# EAGLE design PowerPCB (EAGLE 9.4.2)

## Sheet 1 of 4
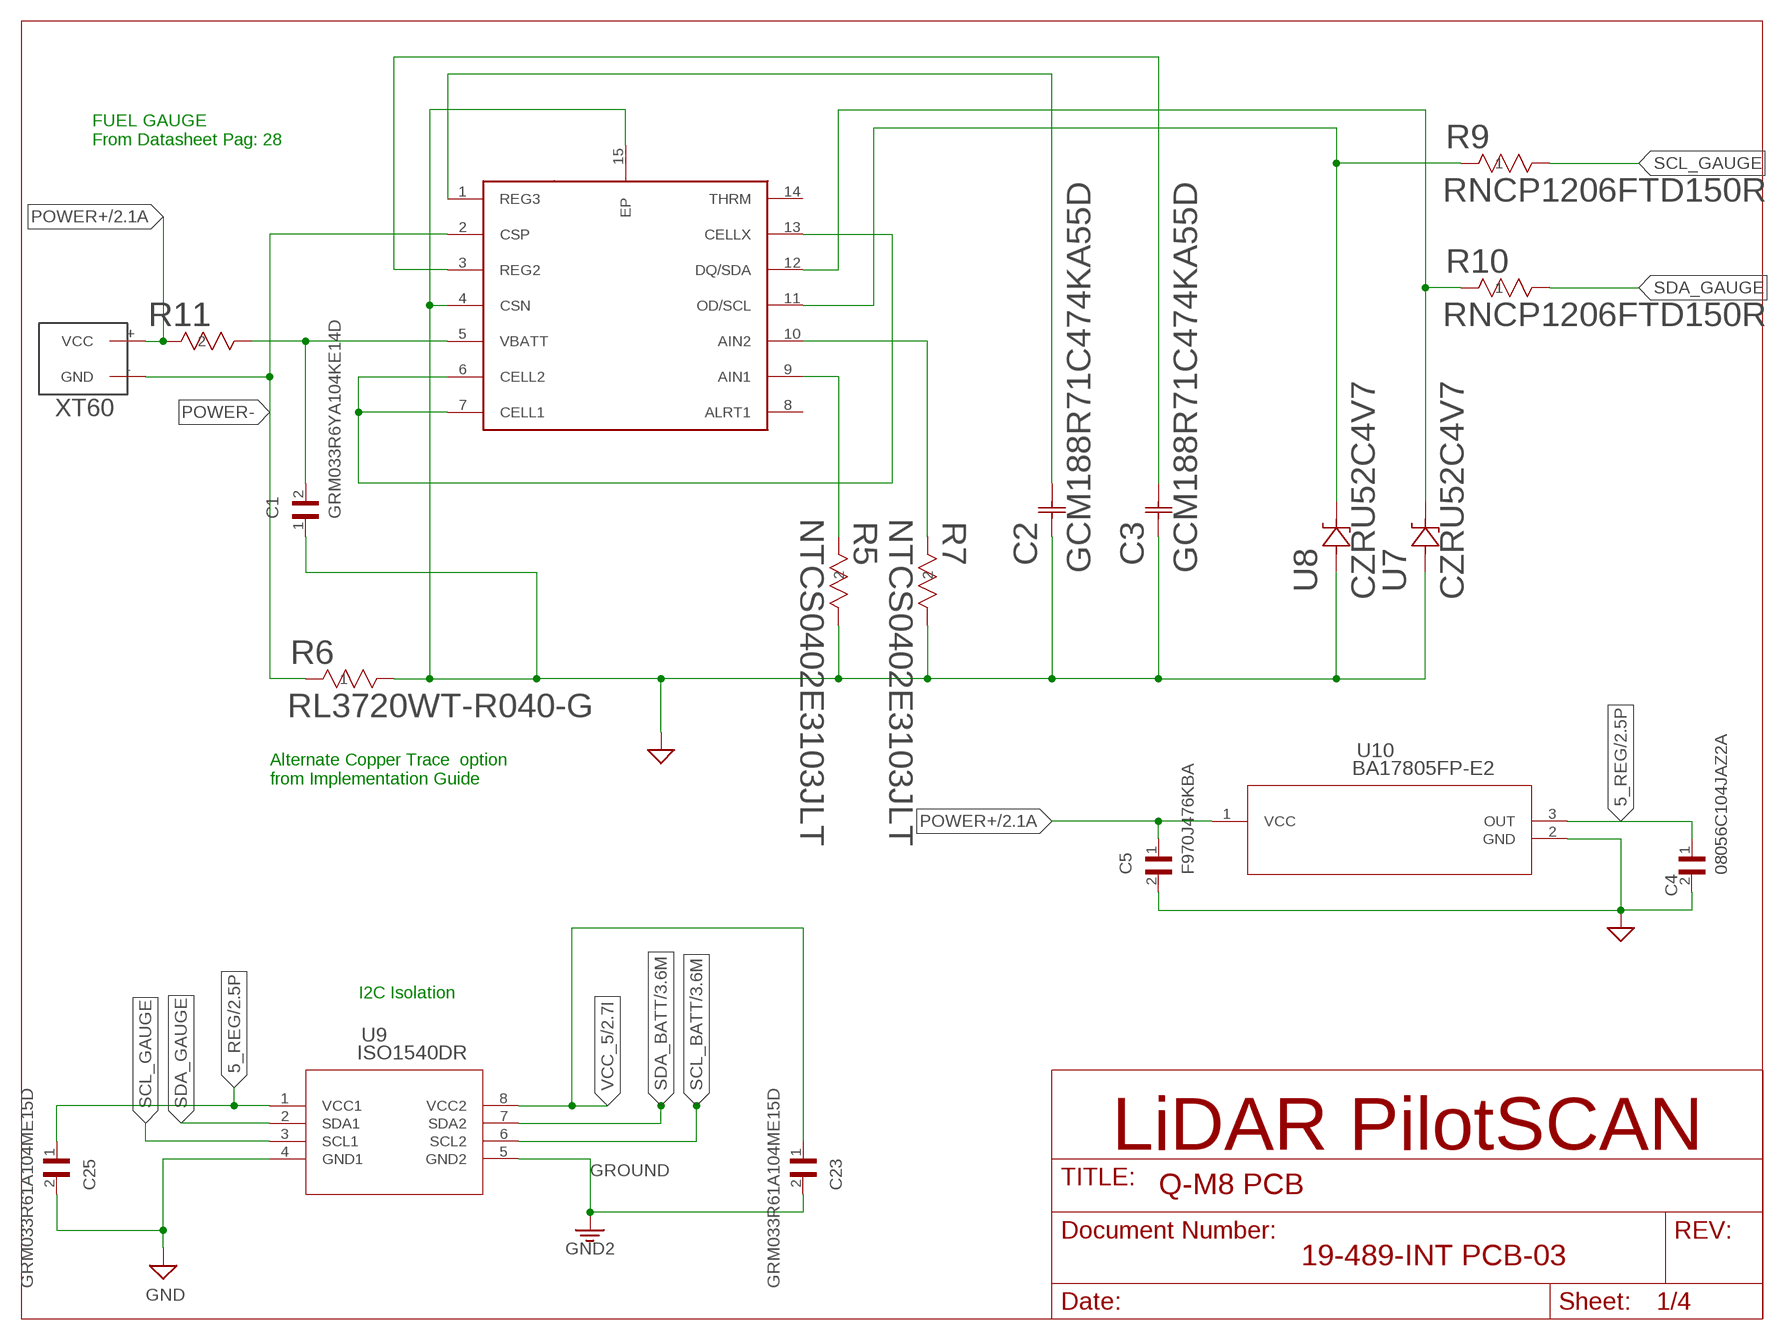
[diagram p0: schematic, sheet 1]

### Parts
C1  GRM033R6YA104KE14D  [CAPC0603X33N]
C2  GCM188R71C474KA55D  [G-188]
C3  GCM188R71C474KA55D  [G-188]
C4  08056C104JAZ2A  [CAPC2012X140N]
C5  F970J476KBA  [CAPPC3528X210N]
C23  GRM033R61A104ME15D  [CAPC0603X33N]
C25  GRM033R61A104ME15D  [CAPC0603X33N]
J5  XT60  [XT60]
R5  NTCS0402E3103JLT  [RES_0402_NTC]
R6  RL3720WT-R040-G  [RES_2037]
R7  NTCS0402E3103JLT  [RES_0402_NTC]
R9  RNCP1206FTD150R  [STA_RNCP1206]
R10  RNCP1206FTD150R  [STA_RNCP1206]
R11  ERA-2AKD100X  [RC0402N]
U5  MAX17205G+T  [MAX17205G+T]
U7  CZRU52C4V7  [CZRU]
U8  CZRU52C4V7  [CZRU]
U9  ISO1540DR  [D8]
U10  BA17805FP-E2  [TO252-3]

### Nets
5_REG: C4.1 C25.1 U9.1(VCC1) U10.3(OUT) ; also sheet 2
GND: C1.1 C2.1 C3.1 C4.2 C5.2 C25.2 R5.1 R6.2 R7.1 U5.4(CSN) U5.15(EP) U7.2 U8.2 U9.4(GND1) U10.2(GND) ; supply symbol labelled SUP ; also sheet 2
GROUND: C23.2 U9.5(GND2) ; supply symbol labelled GND2 ; also sheet 2,3,4
N$7: C1.2 R11.1 U5.5(VBATT)
N$8: R5.2 U5.9(AIN1)
N$25: C2.2 U5.1(REG3)
N$28: R7.2 U5.10(AIN2)
N$31: C3.2 U5.3(REG2)
N$32: U5.6(CELL2) U5.7(CELL1) U5.13(CELLX)
N$34: R9.1 U5.11(OD/SCL) U8.1
N$35: R10.1 U5.12(DQ/SDA) U7.1
POWER+: C5.1 J5.+(VCC) R11.2 U10.1(VCC) ; also sheet 2
POWER-: J5.-(GND) R6.1 U5.2(CSP)
SCL_BATT: U9.6(SCL2) ; also sheet 3
SCL_GAUGE: R9.2 U9.3(SCL1)
SDA_BATT: U9.7(SDA2) ; also sheet 3
SDA_GAUGE: R10.2 U9.2(SDA1)
VCC_5: C23.1 U9.8(VCC2) ; also sheet 2,3,4
Unconnected: U5.8(ALRT1) U5.14(THRM)

### Notes on the sheet
- FUEL GAUGE
  From Datasheet Pag: 28
- Alternate Copper Trace  option
  from Implementation Guide
- I2C Isolation

## Sheet 2 of 4
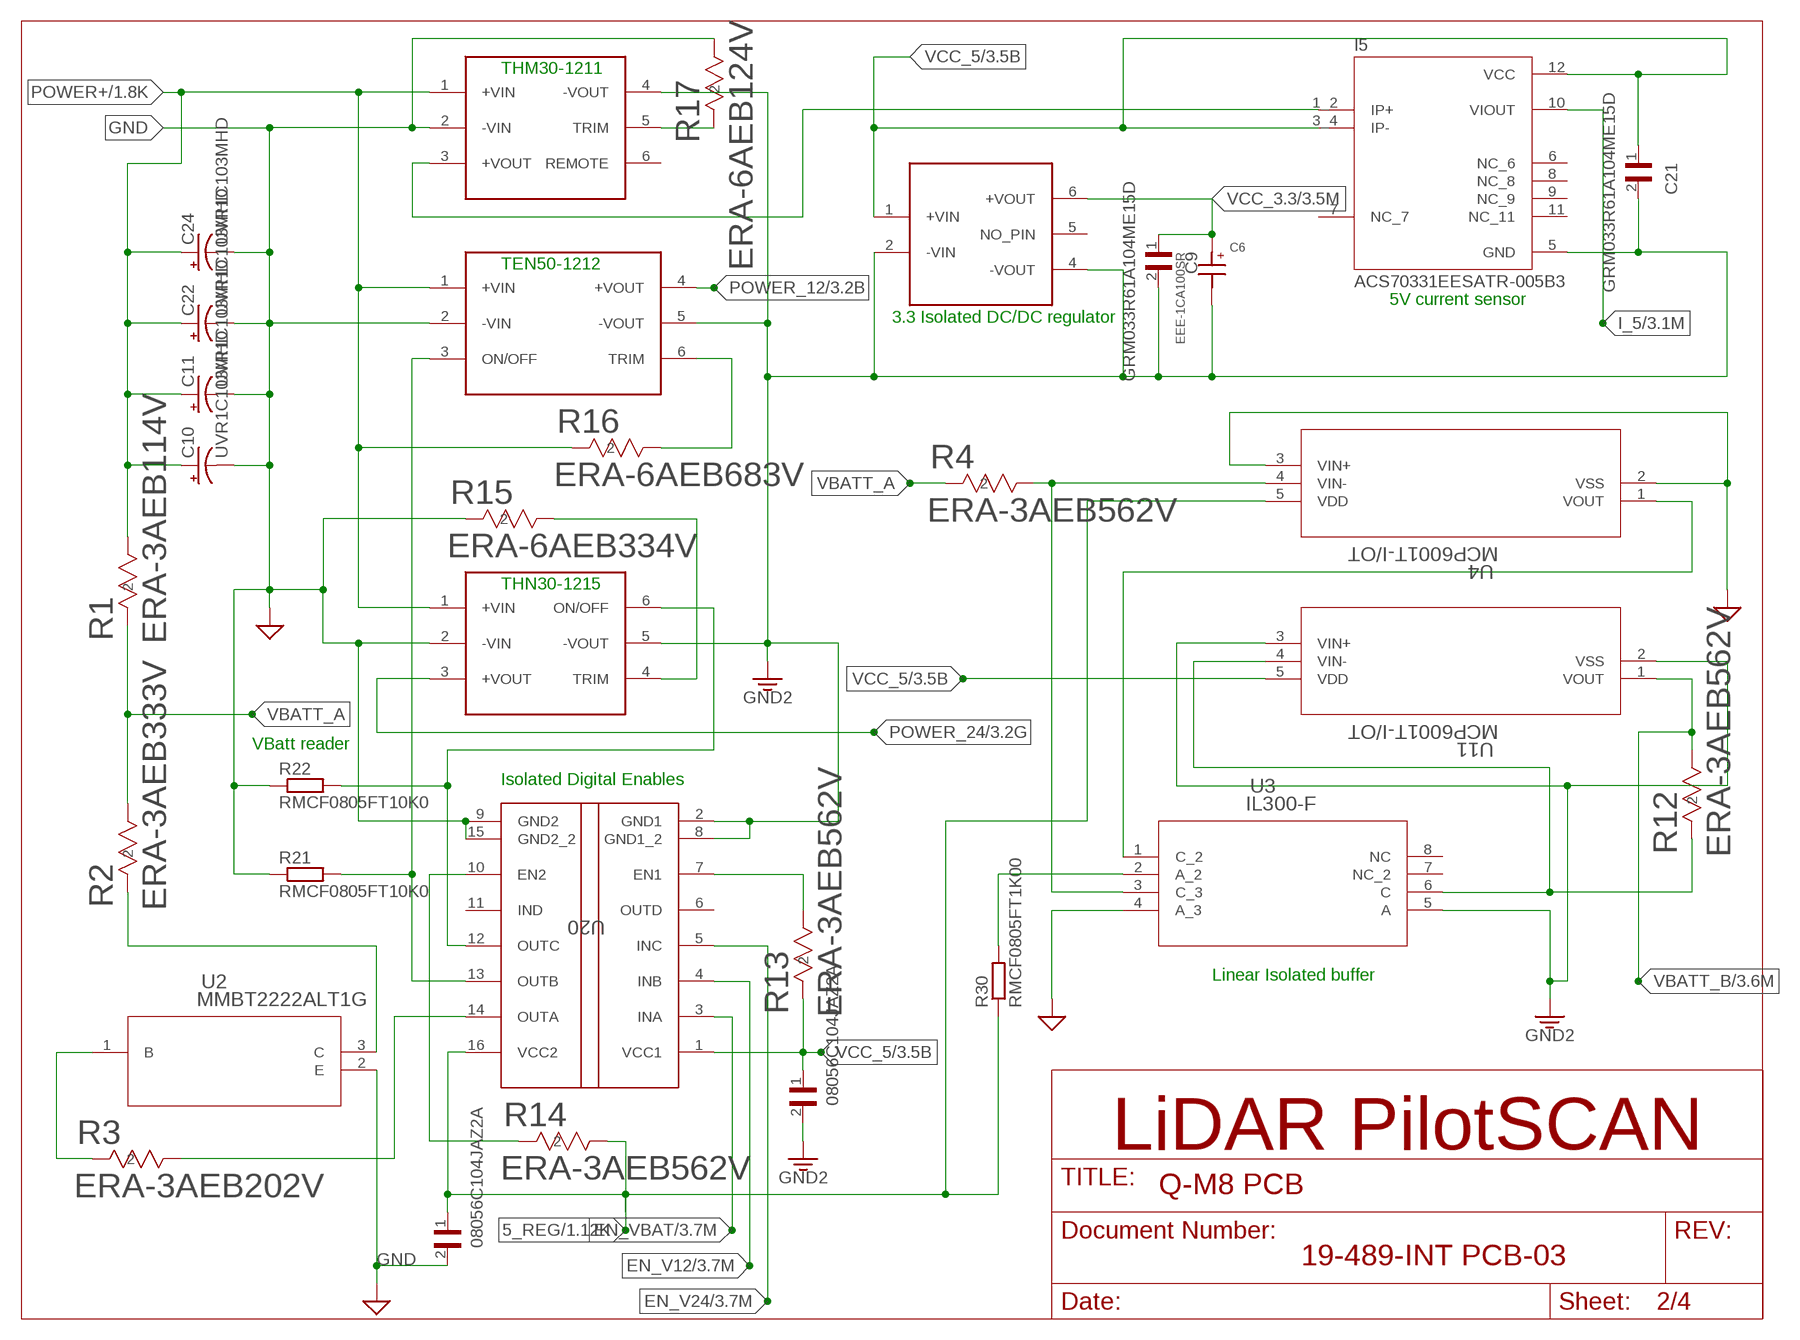
[diagram p1: schematic, sheet 2]

### Parts
C6  EEE-1CA100SR  [CAPAE430X550N]
C7  08056C104JAZ2A  [CAPC2012X140N]
C8  08056C104JAZ2A  [CAPC2012X140N]
C9  GRM033R61A104ME15D  [CAPC0603X33N]
C10  UVR1C103MHD  [U1-PP]
C11  UVR1C103MHD  [U1-PP]
C21  GRM033R61A104ME15D  [CAPC0603X33N]
C22  UVR1C103MHD  [U1-PP]
C24  UVR1C103MHD  [U1-PP]
DCDC5  THM30-1211  [THM30-1211]
DCDC12  TEN50-1212  [TEN50-1212]
DCDC24  THN30-1215  [THN30-1215]
I5  ACS70331EESATR-005B3  [ACS70331EESATR-2P5U3]
R1  ERA-3AEB114V  [RC0603N]
R2  ERA-3AEB333V  [RC0603N]
R3  ERA-3AEB202V  [RC0603N]
R4  ERA-3AEB562V  [RC0603N]
R12  ERA-3AEB562V  [RC0603N]
R13  ERA-3AEB562V  [RC0603N]
R14  ERA-3AEB562V  [RC0603N]
R15  ERA-6AEB334V  [RC0805N]
R16  ERA-6AEB683V  [RC0805N]
R17  ERA-6AEB124V  [RC0805N]
R21  RMCF0805FT10K0  [RMCF0805FT10K0]
R22  RMCF0805FT10K0  [RMCF0805FT10K0]
R30  RMCF0805FT1K00  [RMCF0805FT1K00]
U2  MMBT2222ALT1G  [SOT-23]
U3  IL300-F  [DIP8_IL]
U4  MCP6001T-I/OT  [SOT-23-5_MC]
U6  TMV0503SHI  [TMV0503SHI]
U11  MCP6001T-I/OT  [SOT-23-5_MC]
U20  ISO7741DBQR  [DBQ0016A_N]

### Nets
5_REG: C8.1 R14.1 R30.1 U4.5(VDD) U20.16(VCC2) ; also sheet 1
EN_V12: U20.4(INB) ; also sheet 3
EN_V24: U20.5(INC) ; also sheet 3
EN_VBAT: U20.3(INA) ; also sheet 3
GND: C8.2 C10.2(-) C11.2(-) C22.2(-) C24.2(-) DCDC5.2(-VIN) DCDC12.2(-VIN) DCDC24.2(-VIN) R15.2 R17.1 R21.1 R22.1 U2.2(E) U3.4(A_3) U4.2(VSS) U4.3(VIN+) U20.9(GND2) U20.15(GND2_2) ; supply symbol labelled SUP ; also sheet 1
GROUND: C6.2 C7.2 C9.2 C21.2 DCDC5.4(-VOUT) DCDC12.5(-VOUT) DCDC24.5(-VOUT) I5.5(GND) U3.5(A) U6.2(-VIN) U6.4(-VOUT) U11.2(VSS) U11.3(VIN+) U20.2(GND1) U20.8(GND1_2) ; supply symbol labelled GND2 ; also sheet 1,3,4
I_5: I5.10(VIOUT) ; also sheet 3
N$2: R13.1 U20.7(EN1)
N$3: R3.2 U2.1(B)
N$4: R2.2 U2.3(C)
N$5: R4.1 U3.3(C_3) U4.4(VIN-)
N$6: DCDC12.3(ON/OFF) R21.2 U20.13(OUTB)
N$9: R30.2 U3.2(A_2)
N$10: R14.2 U20.10(EN2)
N$11: U3.1(C_2) U4.1(VOUT)
N$13: R12.2 U3.6(C) U11.4(VIN-)
N$14: DCDC24.6(ON/OFF) R22.2 U20.12(OUTC)
N$15: R3.1 U20.14(OUTA)
N$17: DCDC5.5(TRIM) R17.2
N$18: DCDC24.4(TRIM) R15.1
N$19: DCDC12.6(TRIM) R16.1
POWER+: C10.1(+) C11.1(+) C22.1(+) C24.1(+) DCDC5.1(+VIN) DCDC12.1(+VIN) DCDC24.1(+VIN) R1.1 R16.2 ; also sheet 1
POWER_5: DCDC5.3(+VOUT) I5.1_2(IP+)
POWER_12: DCDC12.4(+VOUT) ; also sheet 3
POWER_24: DCDC24.3(+VOUT) ; also sheet 3
VBATT_A: R1.2 R2.1 R4.2
VBATT_B: R12.1 U11.1(VOUT) ; also sheet 3
VCC_3.3: C6.1 C9.1 U6.6(+VOUT) ; also sheet 3
VCC_5: C7.1 C21.1 I5.3_4(IP-) I5.12(VCC) R13.2 U6.1(+VIN) U11.5(VDD) U20.1(VCC1) ; also sheet 1,3,4
Unconnected: DCDC5.6(REMOTE) I5.6(NC_6) I5.7(NC_7) I5.8(NC_8) I5.9(NC_9) I5.11(NC_11) U3.7(NC_2) U3.8(NC) U6.5(NO_PIN) U20.6(OUTD) U20.11(IND)

### Notes on the sheet
- THM30-1211
- TEN50-1212
- 5V current sensor
- 3.3 Isolated DC/DC regulator
- THN30-1215
- VBatt reader
- Isolated Digital Enables
- Linear Isolated buffer

## Sheet 3 of 4
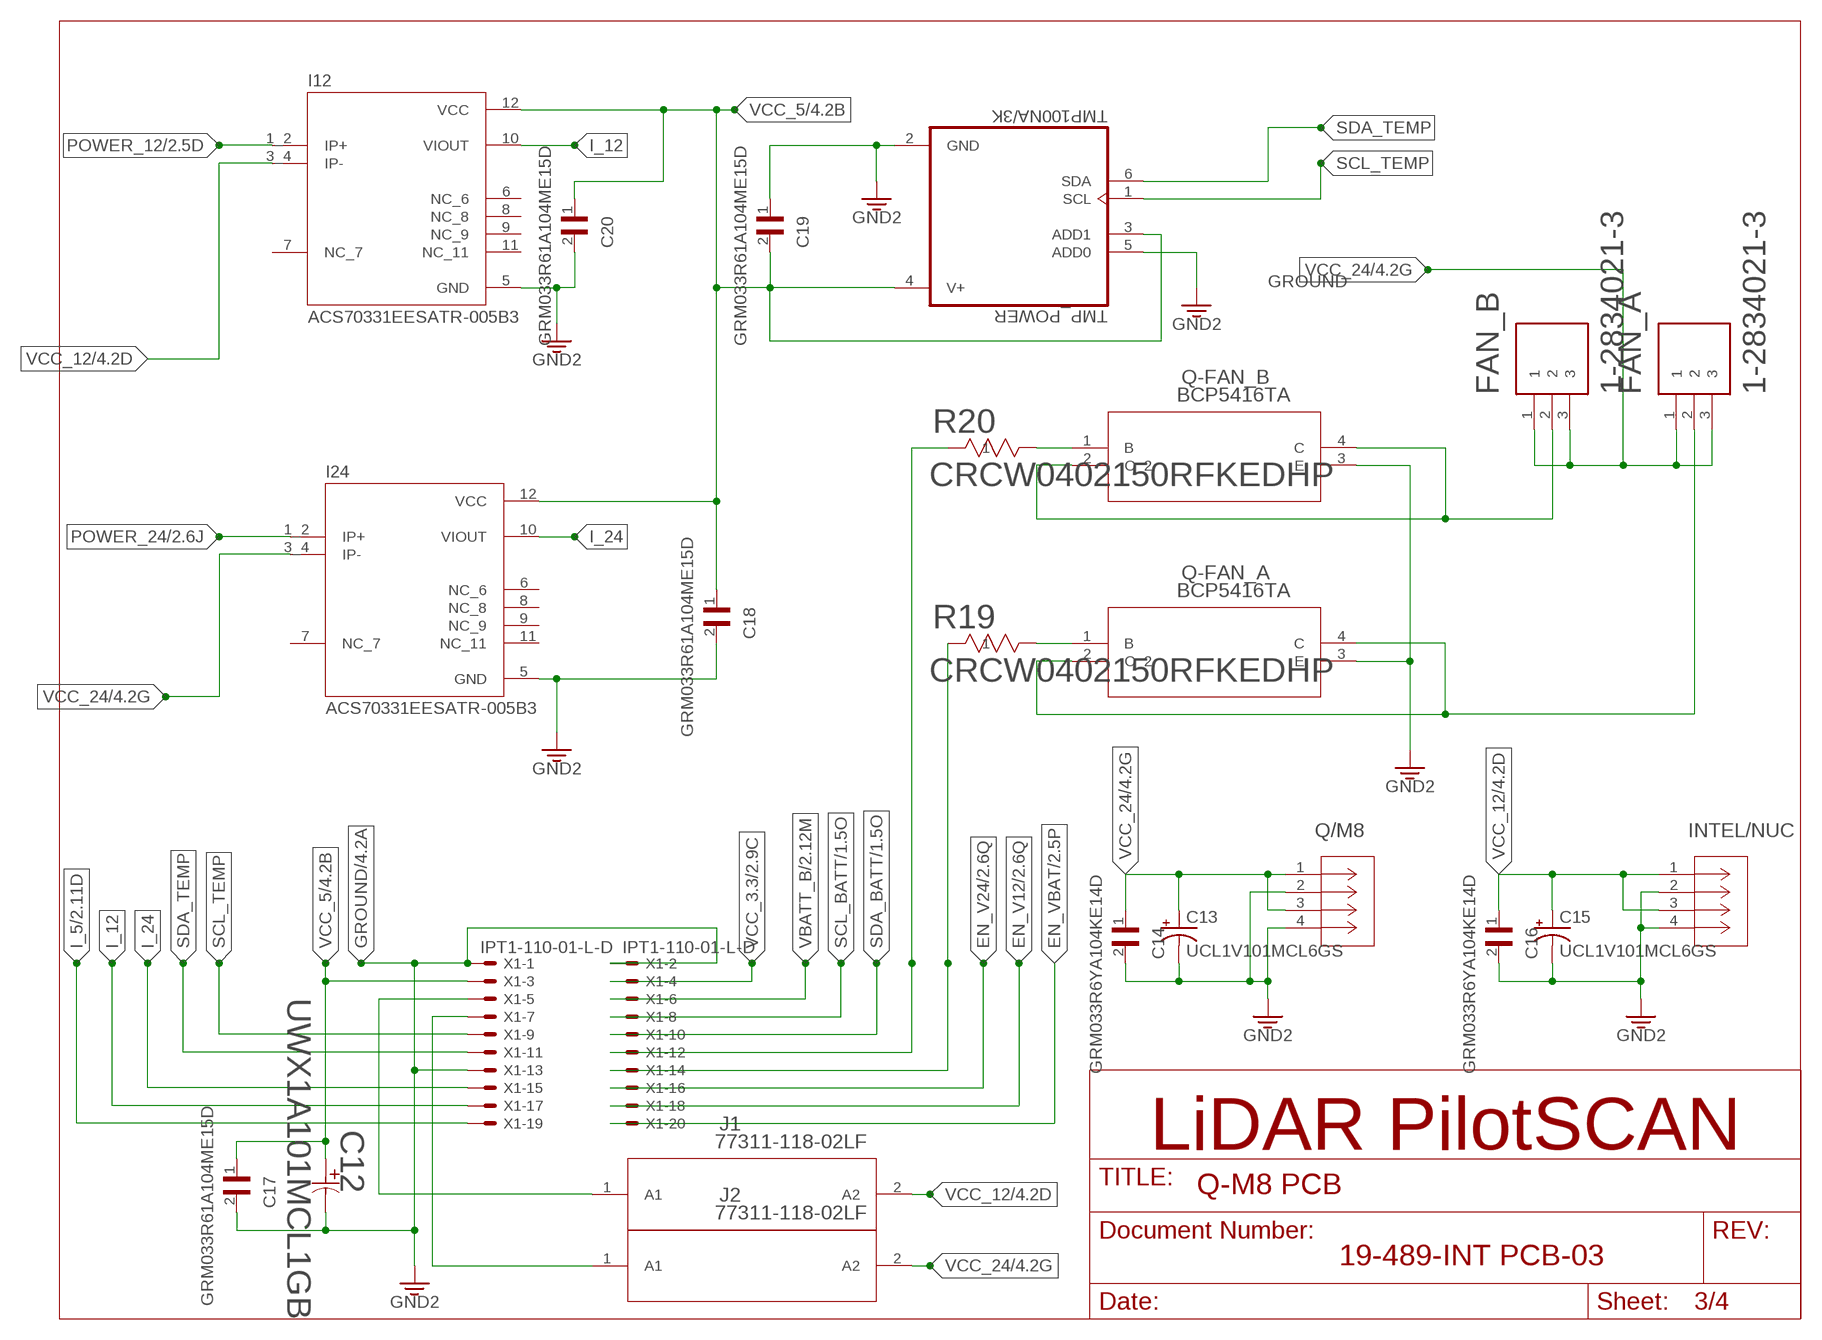
[diagram p2: schematic, sheet 3]

### Parts
C12  UWX1A101MCL1GB  [PCAP_6.3X5.4-ELECT]
C13  UCL1V101MCL6GS  [U2-K]
C14  GRM033R6YA104KE14D  [CAPC0603X33N]
C15  UCL1V101MCL6GS  [U2-K]
C16  GRM033R6YA104KE14D  [CAPC0603X33N]
C17  GRM033R61A104ME15D  [CAPC0603X33N]
C18  GRM033R61A104ME15D  [CAPC0603X33N]
C19  GRM033R61A104ME15D  [CAPC0603X33N]
C20  GRM033R61A104ME15D  [CAPC0603X33N]
FAN_A  1-2834021-3  [CONN_1-2834021-3]
FAN_B  1-2834021-3  [CONN_1-2834021-3]
I12  ACS70331EESATR-005B3  [ACS70331EESATR-2P5U3]
I24  ACS70331EESATR-005B3  [ACS70331EESATR-2P5U3]
INTEL/NUC  3-794630-4  [CON4_2X2_P3MM_VMNL2]
J1  77311-118-02LF  [77311-118-02LF]
J2  77311-118-02LF  [77311-118-02LF]
Q-FAN_A  BCP5416TA  [SOT-223]
Q-FAN_B  BCP5416TA  [SOT-223]
Q/M8  3-794630-4  [CON4_2X2_P3MM_VMNL2]
R19  CRCW0402150RFKEDHP  [RES_CRCW_0402]
R20  CRCW0402150RFKEDHP  [RES_CRCW_0402]
TMP_POWER  TMP100NA/3K  [TMP100NA/3K]
X1  IPT1-110-01-L-D  [IPT1-110-01-L-D]

### Nets
EN_V12: X1.P$18 ; also sheet 2
EN_V24: X1.P$16 ; also sheet 2
EN_VBAT: X1.P$20 ; also sheet 2
GROUND: C12.2 C13.2(-) C14.2 C15.2(-) C16.2 C17.2 C18.2 C19.1 C20.2 I12.5(GND) I24.5(GND) INTEL/NUC.2 INTEL/NUC.4 Q-FAN_A.3(E) Q-FAN_B.3(E) Q/M8.2 Q/M8.4 TMP_POWER.2(GND) TMP_POWER.5(ADD0) X1.P$1 X1.P$2 X1.P$13 ; supply symbol labelled GND2 ; also sheet 1,2,4
I_5: X1.P$19 ; also sheet 2
I_12: I12.10(VIOUT) X1.P$17
I_24: I24.10(VIOUT) X1.P$15
N$12: J1.1(A1) X1.P$5
N$16: J2.1(A1) X1.P$7
N$21: FAN_A.2 Q-FAN_A.2(C_2) Q-FAN_A.4(C)
N$22: R20.1 X1.P$12
N$23: R19.1 X1.P$14
N$24: Q-FAN_B.1(B) R20.2
N$26: Q-FAN_A.1(B) R19.2
N$27: FAN_B.2 Q-FAN_B.2(C_2) Q-FAN_B.4(C)
POWER_12: I12.1_2(IP+) ; also sheet 2
POWER_24: I24.1_2(IP+) ; also sheet 2
SCL_BATT: X1.P$8 ; also sheet 1
SCL_TEMP: TMP_POWER.1(SCL) X1.P$9
SDA_BATT: X1.P$10 ; also sheet 1
SDA_TEMP: TMP_POWER.6(SDA) X1.P$11
VBATT_B: X1.P$6 ; also sheet 2
VCC_3.3: X1.P$4 ; also sheet 2
VCC_5: C12.1 C17.1 C18.1 C19.2 C20.1 I12.12(VCC) I24.12(VCC) TMP_POWER.3(ADD1) TMP_POWER.4(V+) X1.P$3 ; also sheet 1,2,4
VCC_12: C15.1(+) C16.1 I12.3_4(IP-) INTEL/NUC.1 INTEL/NUC.3 J1.2(A2) ; also sheet 4
VCC_24: C13.1(+) C14.1 FAN_A.1 FAN_A.3 FAN_B.1 FAN_B.3 I24.3_4(IP-) J2.2(A2) Q/M8.1 Q/M8.3 ; also sheet 4
Unconnected: I12.6(NC_6) I12.7(NC_7) I12.8(NC_8) I12.9(NC_9) I12.11(NC_11) I24.6(NC_6) I24.7(NC_7) I24.8(NC_8) I24.9(NC_9) I24.11(NC_11)

## Sheet 4 of 4
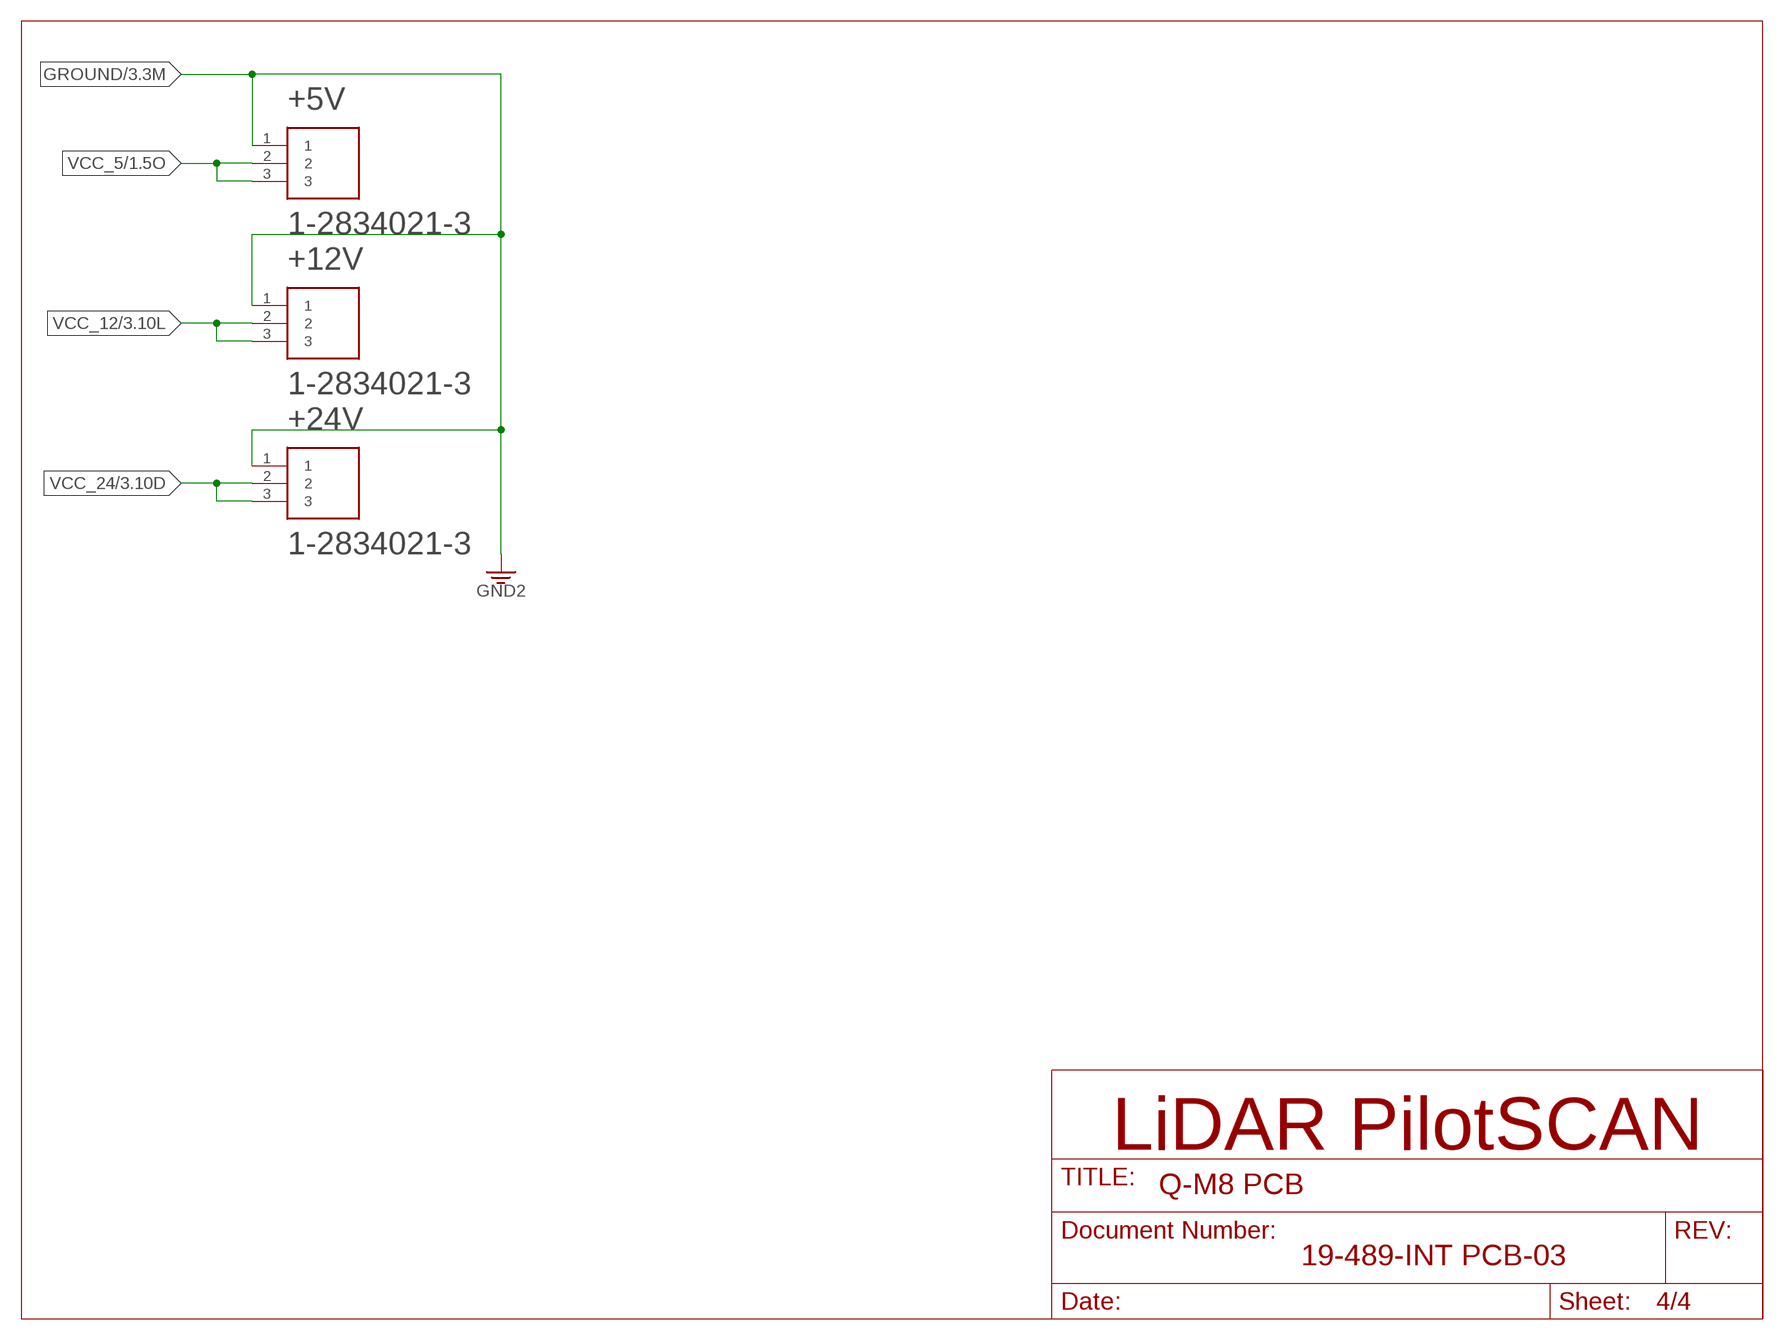
[diagram p3: schematic, sheet 4]

### Parts
+5V  1-2834021-3  [CONN_1-2834021-3]
+12V  1-2834021-3  [CONN_1-2834021-3]
+24V  1-2834021-3  [CONN_1-2834021-3]

### Nets
GROUND: +5V.1 +12V.1 +24V.1 ; supply symbol labelled GND2 ; also sheet 1,2,3
VCC_5: +5V.2 +5V.3 ; also sheet 1,2,3
VCC_12: +12V.2 +12V.3 ; also sheet 3
VCC_24: +24V.2 +24V.3 ; also sheet 3

## Library data of the parts
+5V +12V +24V FAN_A FAN_B = 1-2834021-3:1-2834021-3: Conn PC Terminal Block RCP 3 POS 2.5mm Solder ST Thru-Hole 5A/Contact Box/Carton; COMMENT: 1-2834021-3; DESCRIPTION: Conn PC Terminal Block RCP 3 POS 2.5mm Solder ST Thru-Hole 5A/Contact Box/Carton; DIGI-KEY_PART_NUMBER: A123845-ND; DIGI-KEY_PURCHASE_URL: https://www.digikey.com.co/product-detail/en/te-connectivity-amp-connectors/1-2834021-3/A123845-ND/5872961?utm_source=snapeda&utm_medium=aggregator&utm_campaign=symbol; MF: TE Connectivity; MP: 1-2834021-3; PACKAGE: None; TE_PURCHASE_URL: https://www.te.com/usa-en/product-1-2834021-3.html?te_bu=Cor&te_type=disp&te_campaign=seda_glo_cor-seda-global-disp-prtnr-fy19-seda-model-bom-cta_sma-317_1&elqCampaignId=32493
C1 C14 C16 = GRM033R6YA104KE14D:GRM033R6YA104KE14D: CAP CER 0.1UF 35V X5R 0201; DESCRIPTION: Cap 0.1uf 35vdc X5r 10% Smd 0201 Paper Tape; DIGI-KEY_PART_NUMBER: 490-10430-1-ND; DIGI-KEY_PURCHASE_URL: https://www.digikey.com.co/product-detail/en/murata-electronics/GRM033R6YA104KE14D/490-10430-1-ND/5026320?utm_source=snapeda&utm_medium=aggregator&utm_campaign=symbol; MF: Murata Electronics; MP: GRM033R6YA104KE14D; PACKAGE: 0603 Taiyo Yuden
C2 C3 = GCM188R71C474KA55D:GCM188R71C474KA55D; MANUFACTURER_PART_NUMBER: GCM188R71C474KA55D; VENDOR: Murata
C4 C7 C8 = 08056C104JAZ2A:08056C104JAZ2A: Cap Ceramic 0.1uF 6.3V X7R 5% SMD 0805 FlexiTerm 125°C T/R; AVAILABILITY: Unavailable; DESCRIPTION: 0805 100 nF 6.3 V ±5 % Tolerance X7R SMT Multilayer Ceramic Capacitor; MF: AVX; MP: 08056C104JAZ2A; PACKAGE: 0805 AVX; PRICE: None
C5 = F970J476KBA:F970J476KBA: CAP TANT 47UF 10% 6.3V SMD; AVAILABILITY: Unavailable; DESCRIPTION: Cap Tant 47uf 10% 6.3v Smd; MF: AVX; MP: F970J476KBA; PACKAGE: 1210 AVX; PRICE: None
C6 = EEE-1CA100SR:EEE-1CA100SR: Capacitor Alum Elec, 10uf, 16v, 20%, Scapacitor Alum Elec, 10uf, 16v, 20%, Smd, Full Reel; DESCRIPTION: Capacitor Alum Elec, 10uf, 16v, 20%, Scapacitor Alum Elec, 10uf, 16v, 20%, Smd, Full Reel; DIGI-KEY_PART_NUMBER: PCE3878CT-ND; DIGI-KEY_PURCHASE_URL: https://www.digikey.com.co/product-detail/en/panasonic-electronic-components/EEE-1CA100SR/PCE3878CT-ND/766254?utm_source=snapeda&utm_medium=aggregator&utm_campaign=symbol; MF: Panasonic; MP: EEE-1CA100SR; PACKAGE: Radial Panasonic
C9 C17-C21 C23 C25 = GRM033R61A104ME15D:GRM033R61A104ME15D: .1UF 10V 20% 0201; DESCRIPTION: 0201 0.1 uF 10 V ±20% Tolerance X5R SMT Multilayer Ceramic Capacitor; DIGI-KEY_PART_NUMBER: 490-5405-1-ND; DIGI-KEY_PURCHASE_URL: https://www.digikey.com.co/product-detail/en/murata-electronics/GRM033R61A104ME15D/490-5405-1-ND/2175212?utm_source=snapeda&utm_medium=aggregator&utm_campaign=symbol; MF: Murata Electronics; MP: GRM033R61A104ME15D; PACKAGE: 0603 Taiyo Yuden
C10 C11 C22 C24 = 16PX10000MEFC16X31.5:UVR1C103MHD; MANUFACTURER_PART_NUMBER: UVR1C103MHD; VENDOR: Nichicon
C12 = UWX1A101MCL1GB:UWX1A101MCL1GB; MANUFACTURER_PART_NUMBER: UWX1A101MCL1GB; VENDOR: Nichicon
C13 C15 = UCL1V101MCL6GS:UCL1V101MCL6GS; MANUFACTURER_PART_NUMBER: UCL1V101MCL6GS; VENDOR: Nichicon
DCDC5 = THM 30-1211:THM30-1211
DCDC12 = TEN 50-1212 :TEN50-1212
DCDC24 = THN 30-1215:THN30-1215
I5 I12 I24 = ACS70331EESATR-2P5U3:ACS70331EESATR-005B3: Current Sensor Current Sensor AC/DC Current 12-Pin QFN EP T/R; AVAILABILITY: Unavailable; DESCRIPTION: Current Sensor Current Sensor AC/DC Current 12-Pin QFN EP T/R; MF: Allegro MicroSystems LLC; MP: ACS70331EESATR-005B3; PACKAGE: WFQFN-12 Allegro MicroSystems LLC; PRICE: None
INTEL/NUC Q/M8 = 3-794630-4:3-794630-4; MANUFACTURER_PART_NUMBER: 37946304; VENDOR: TE Connectivity
J1 J2 = 77311-118-02LF:77311-118-02LF; MANUFACTURER_PART_NUMBER: 7731111802LF; VENDOR: Amphenol FCI
J5 = XT60:XT60: XT60
Q-FAN_A Q-FAN_B = BCP5416TA:BCP5416TA; MANUFACTURER_PART_NUMBER: BCP5416TA; VENDOR: Diodes Inc
R1 = ERA-3AEB114V:ERA-3AEB114V; MANUFACTURER_PART_NUMBER: ERA3AEB114V; VENDOR: Panasonic
R2 = ERA-3AEB333V:ERA-3AEB333V; MANUFACTURER_PART_NUMBER: ERA3AEB333V; VENDOR: Panasonic
R3 = ERA-3AEB202V:ERA-3AEB202V; MANUFACTURER_PART_NUMBER: ERA3AEB202V; VENDOR: Panasonic
R4 R12-R14 = ERA-3AEB562V:ERA-3AEB562V; MANUFACTURER_PART_NUMBER: ERA3AEB562V; VENDOR: Panasonic
R5 R7 = NTCS0402E3103JLT:NTCS0402E3103JLT; MANUFACTURER_PART_NUMBER: NTCS0402E3103JLT; VENDOR: Vishay
R6 = RL3720WT-R040-G:RL3720WT-R040-G; MANUFACTURER_PART_NUMBER: RL3720WTR040G; VENDOR: Susumu
R9 R10 = RNCP1206FTD150R:RNCP1206FTD150R; MANUFACTURER_PART_NUMBER: RNCP1206FTD150R; VENDOR: Stackpole International
R11 = ERA-2AKD100X:ERA-2AKD100X; MANUFACTURER_PART_NUMBER: ERA2AKD100X; VENDOR: Panasonic
R15 = ERA-6AEB334V:ERA-6AEB334V; MANUFACTURER_PART_NUMBER: ERA6AEB334V; VENDOR: Panasonic
R16 = ERA-6AEB683V:ERA-6AEB683V; MANUFACTURER_PART_NUMBER: ERA6AEB683V; VENDOR: Panasonic
R17 = ERA-6AEB124V:ERA-6AEB124V; MANUFACTURER_PART_NUMBER: ERA6AEB124V; VENDOR: Panasonic
R19 R20 = CRCW0402150RFKEDHP:CRCW0402150RFKEDHP; MANUFACTURER_PART_NUMBER: CRCW0402150RFKEDHP; VENDOR: Vishay
R21 R22 = RMCF0805FT10K0:RMCF0805FT10K0
R30 = RMCF0805FT1K00:RMCF0805FT1K00
TMP_POWER = TMP100NA_3K:TMP100NA/3K: Digital Temperature Sensor with I2C Interface; AVAILABILITY: Unavailable; DESCRIPTION: Temperature Sensor with I2C/SMBus Interface in SOT-23 6-SOT-23 -55 to 125; MF: Texas Instruments; MP: TMP100NA/3K; PACKAGE: SOT-23 Texas Instruments; PRICE: None
U2 = MMBT2222ALT1G:MMBT2222ALT1G; MANUFACTURER_PART_NUMBER: MMBT2222ALT1G; VENDOR: ON Semiconductor
U3 = IL300-F:IL300-F; MANUFACTURER_PART_NUMBER: IL300F; VENDOR: Vishay
U4 U11 = MCP6001T-I:OT:MCP6001T-I/OT; MANUFACTURER_PART_NUMBER: MCP6001TIOT; VENDOR: Microchip
U5 = MAX17205G+T:MAX17205G+T: The MAX1720x/MAX1721x are ultra-low power stand-alone fuel gauge ICs that implement the Maxim ModelGauge™ m5 algorithm without requiring host interaction for configuration. This feature makes the MAX1720x/MAX1721x excellent pack-side fuel gauges. The MAX17201/MAX17211 monitor a single cell pack. The MAX17205/MAX17215 monitor and balance a 2S or 3S pack or monitor a multiple-series cell pack.; A_MAX: 0.8; B_MAX: 0.25; B_MIN: 0.15; B_NOM: 0.2; D2_NOM: 2.3; D_MAX: 3.1; D_MIN: 2.9; D_NOM: 3.0; E2_NOM: 1.7; ENOM: 0.4; E_MAX: 3.1; E_MIN: 2.9; E_NOM: 3.0; L_MAX: 0.4; L_MIN: 0.2; L_NOM: 0.3; MANUFACTURER: Maxim Integrated; PIN_COUNT: 14.0; SNAPEDA_PACKAGE_ID: 70540; STANDARD: IPC 7351B
U6 = TMV 0503SHI:TMV0503SHI
U7 U8 = CZRU52C4V7:CZRU52C4V7; MANUFACTURER_PART_NUMBER: CZRU52C4V7; VENDOR: Comchip
U9 = ISO1540DR:ISO1540DR; MANUFACTURER_PART_NUMBER: ISO1540DR; VENDOR: Texas Instruments
U10 = BA17805FP-02:BA17805FP-E2; MANUFACTURER_PART_NUMBER: BA17805FPE2; VENDOR: ROHM Semiconductor
U20 = ISO7741DBQR:ISO7741DBQR
X1 = IPT-110-01-L-D:IPT1-110-01-L-D: 20 Pin - 2mm Dual Row Source: www.mpe-connector.de / garry_shortform_2012.pdf

## Net classes
0 default: width 0.203 mm
1 Tierra: width 0.508 mm, clearance 1.016 mm

## Board
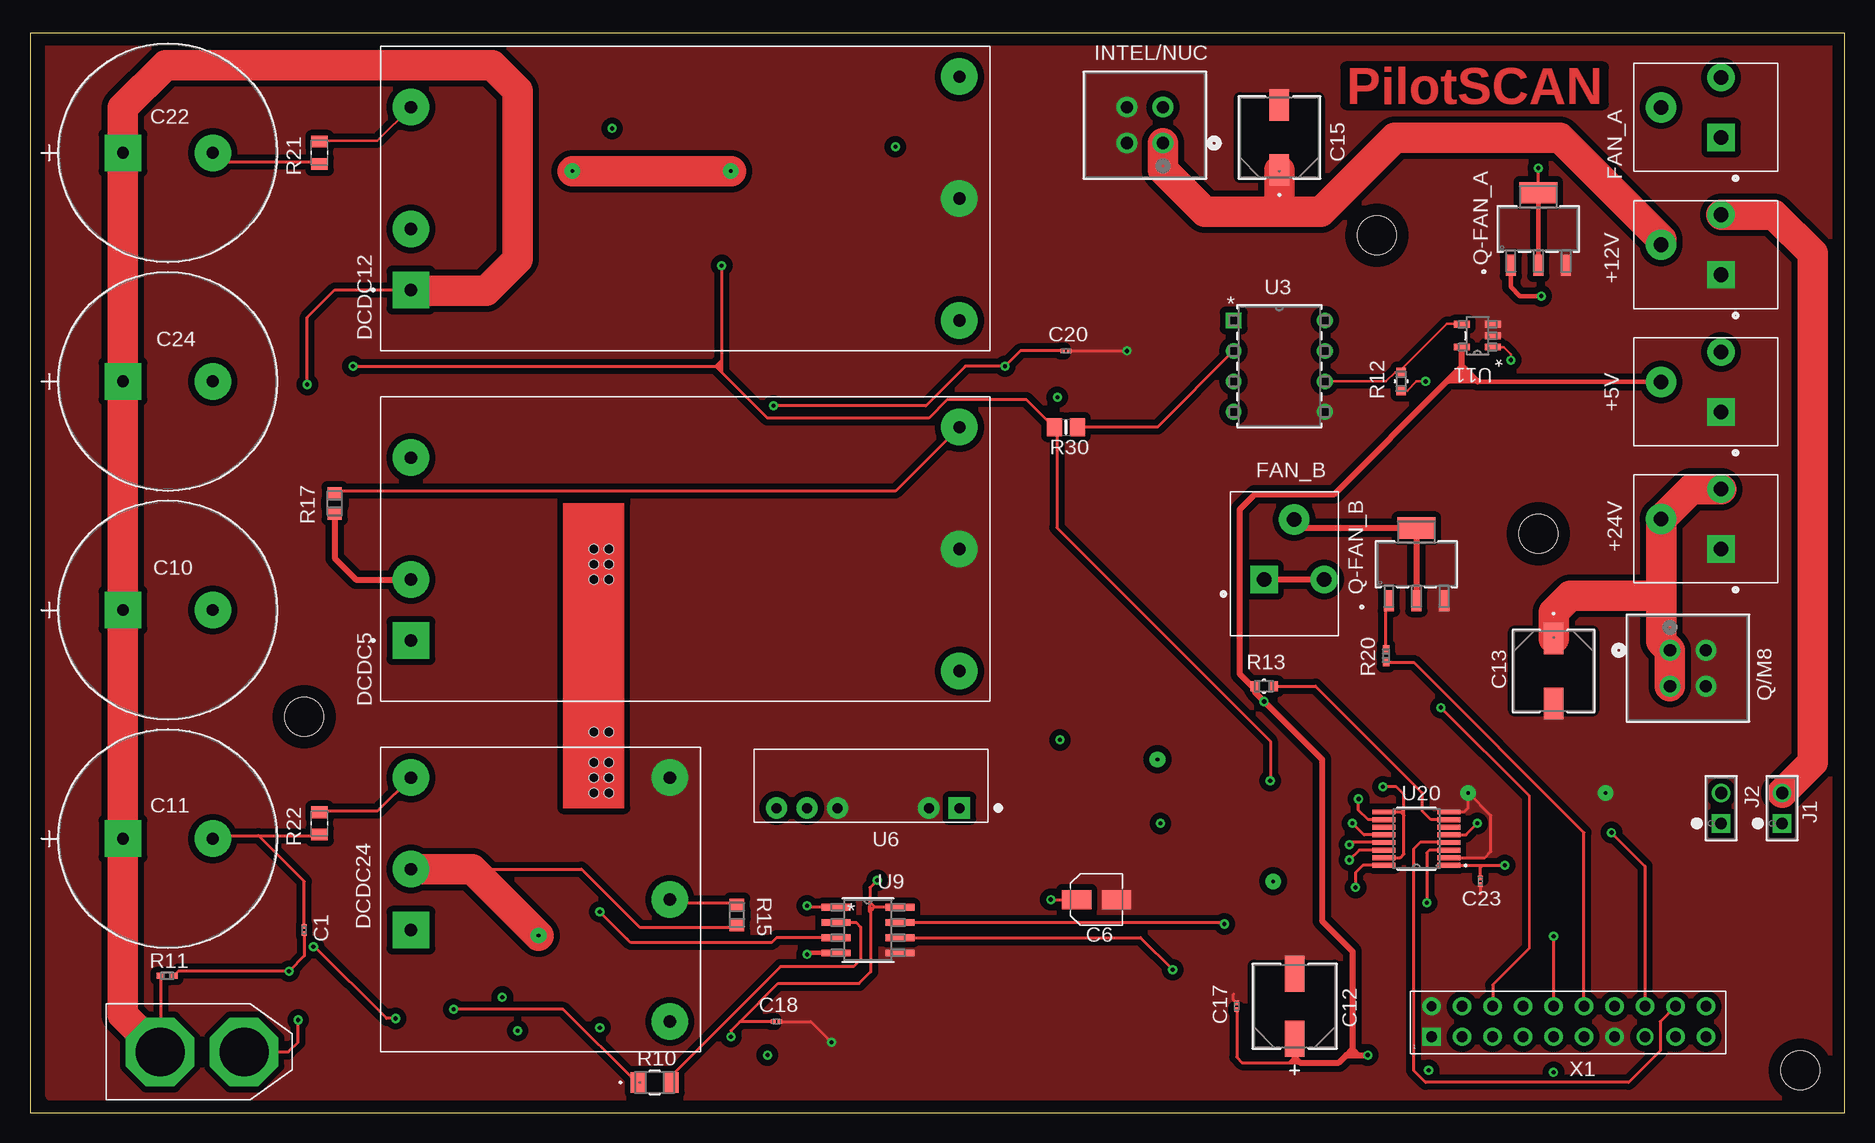
[diagram p4: board, top side]
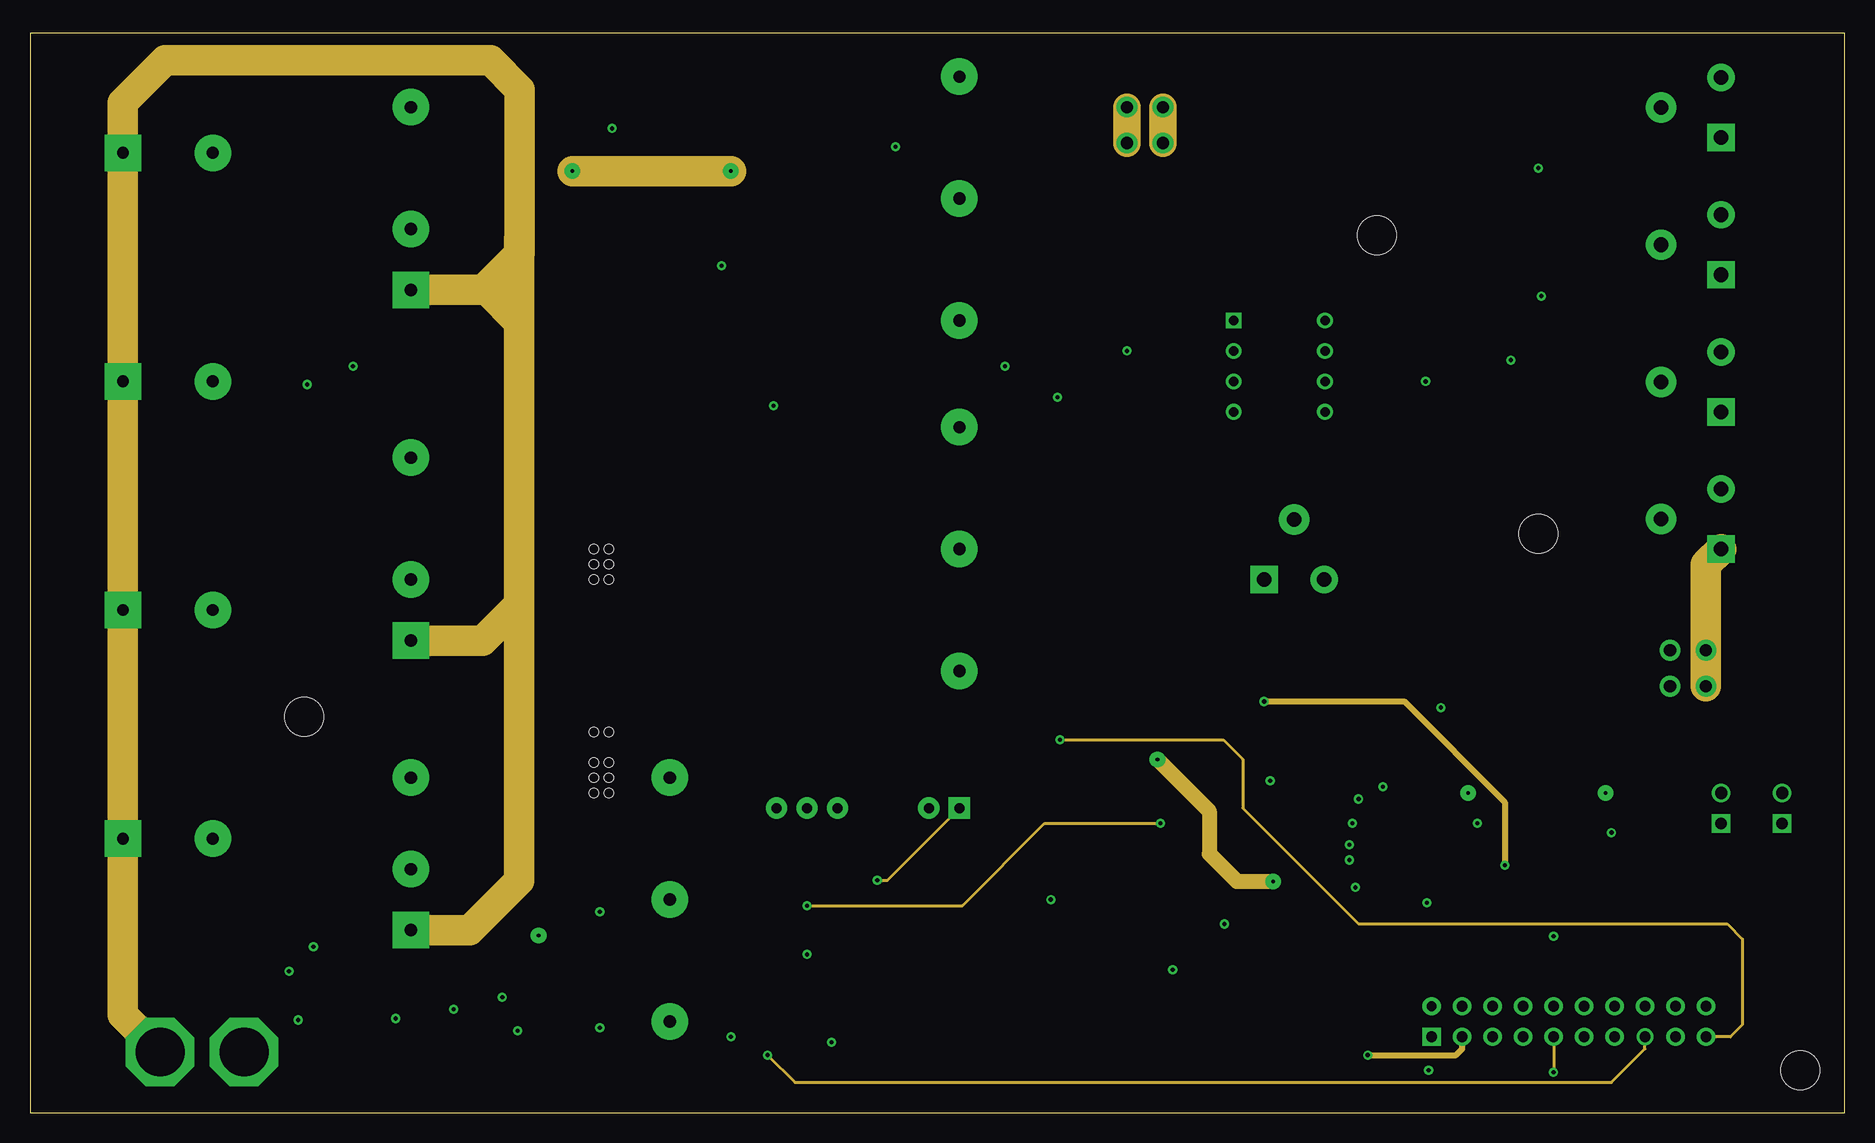
[diagram p5: board, inner layer Route2]
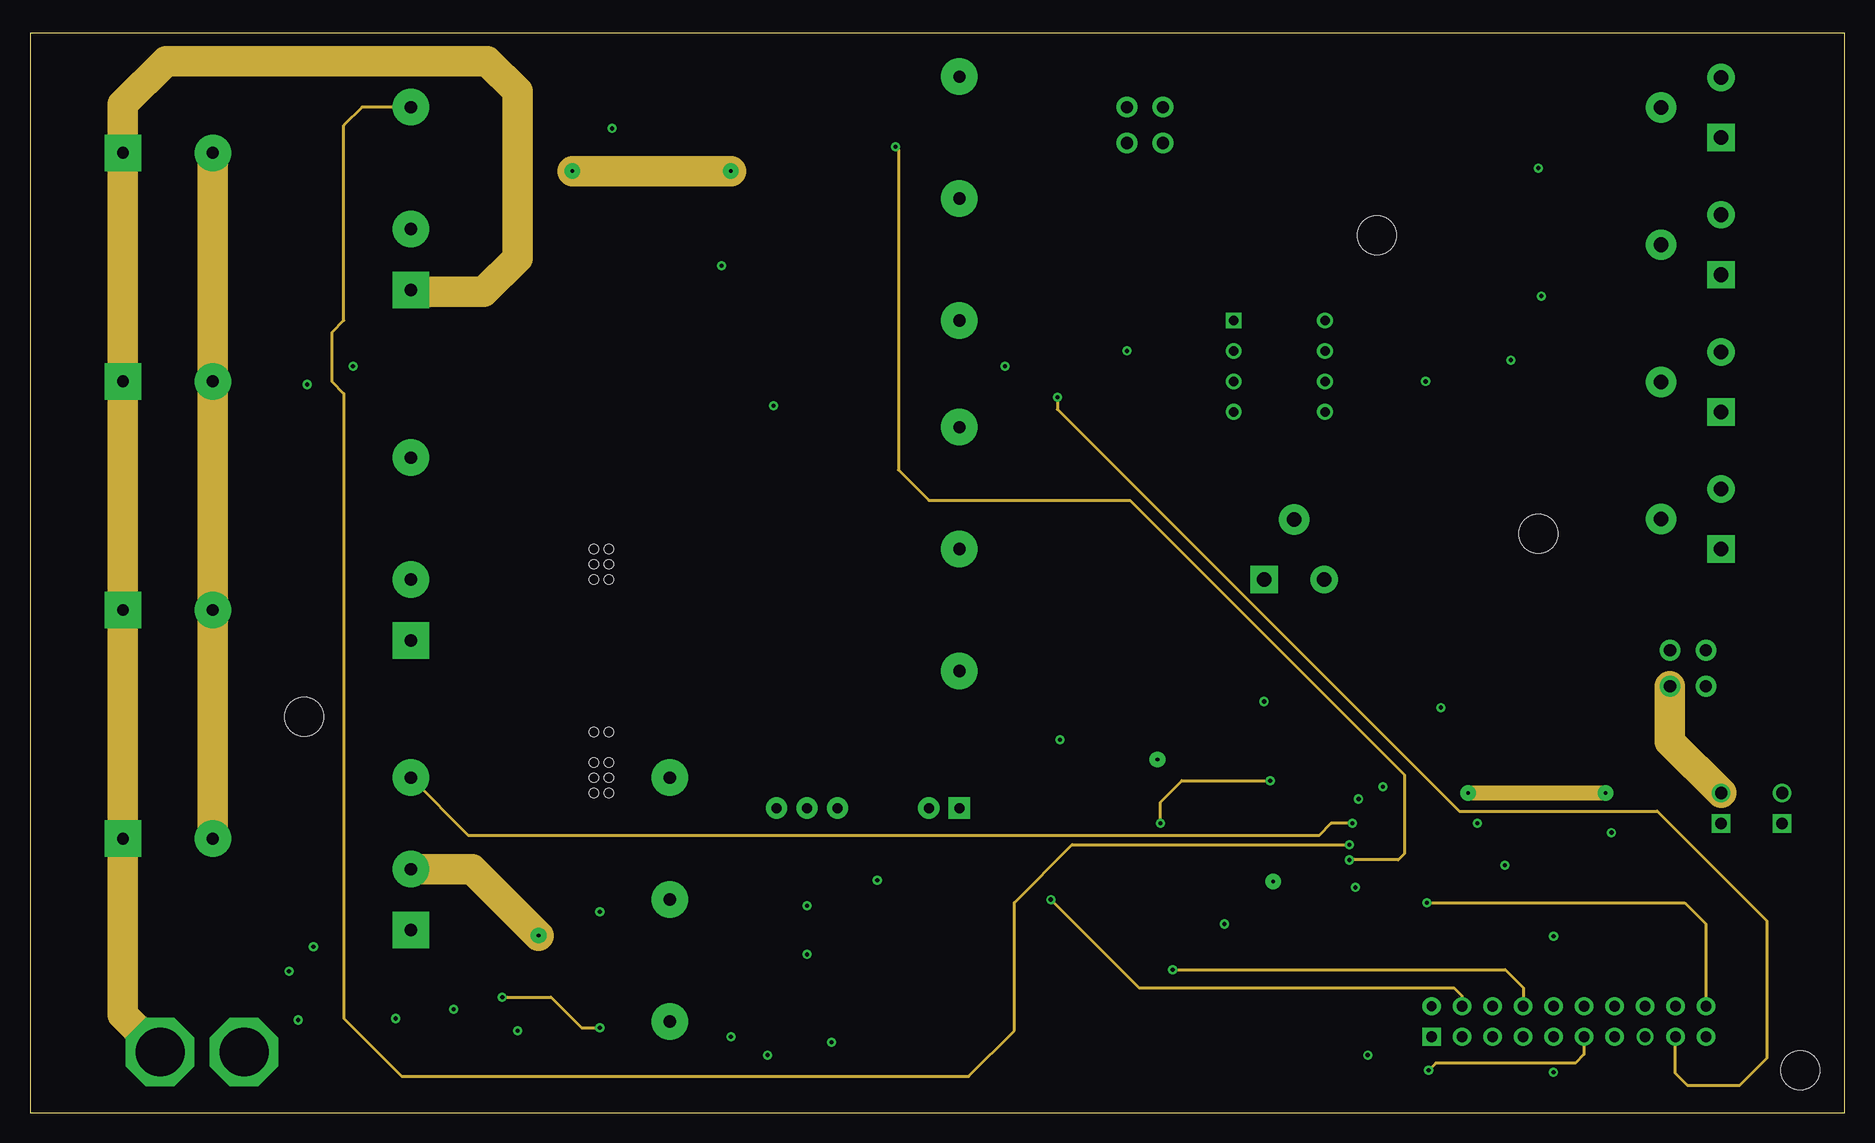
[diagram p6: board, inner layer Route15]
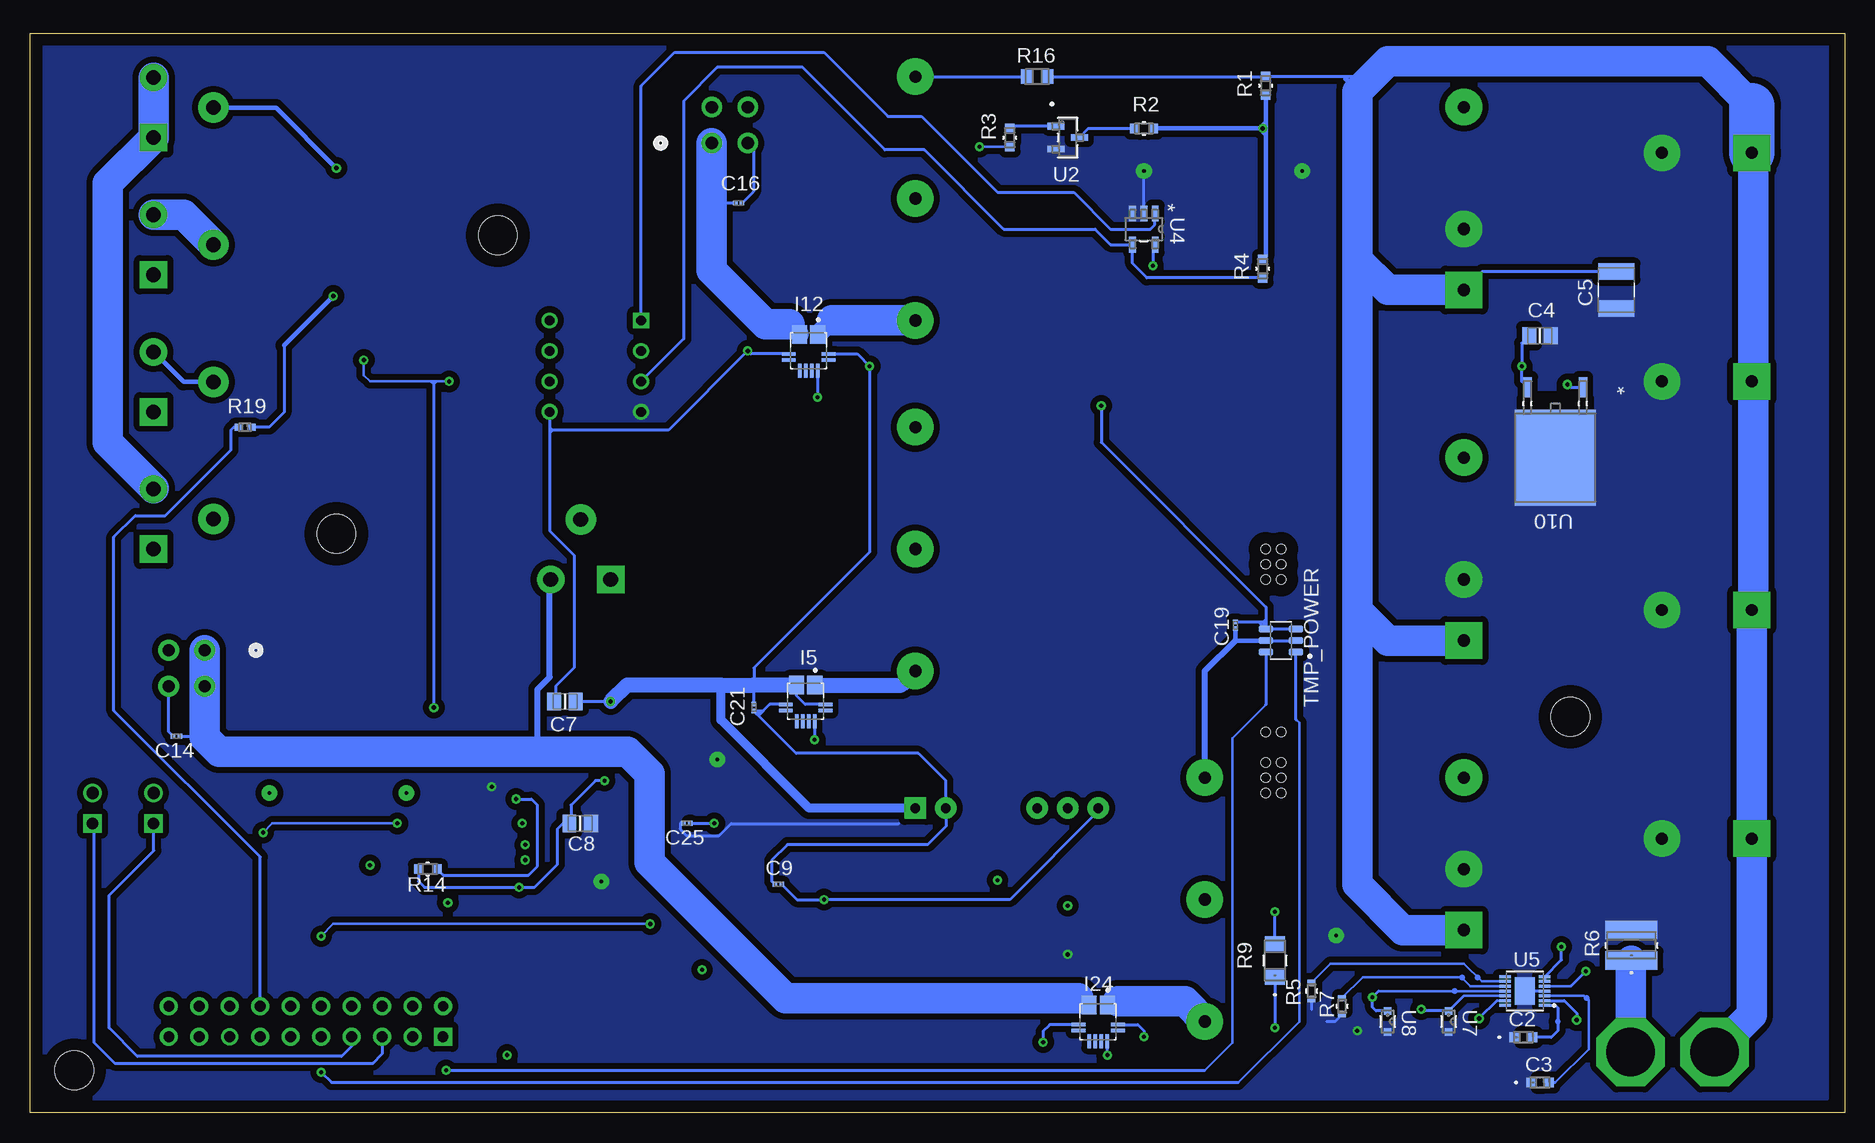
[diagram p7: board, bottom side, seen from below]

Size 151.27 x 89.99 mm. Coordinates in mm from the lower left corner, seen from the top.
Outline: 0,0 151.27,0 151.27,89.99 0,89.99 0,0
Copper layers (1+2*15+16): Top 0.035mm / dielectric 1.5mm / Route2 0.035mm / dielectric 0.15mm / Route15 0.035mm / dielectric 0.2mm / Bottom 0.035mm
Design rules "default *": minimum track width 6mil, minimum drill 0.25mm, track to track 10mil, track to pad 6mil, pad to pad 6mil, via to via 10mil, smd to smd 7mil, copper to edge 40mil, drill to drill 6mil, minimum pad ring 10mil, minimum via ring 8mil, stop-mask expansion 4mil, vias tented up to drill 0mil, thermal gap 10mil
Holes 0.76 mm at 48.26,29.21 48.26,31.75 48.26,46.99 46.99,46.99 46.99,31.75 46.99,29.21 48.26,45.72 46.99,45.72 46.99,44.45 48.26,44.45 48.26,27.94 46.99,27.94 48.26,26.67 46.99,26.67
Holes 3.23 mm at 112.27,73.15 22.86,33.02 125.73,48.26 147.57,3.56

### Footprints (pad centres in the part's own frame; a part is rotated, then mirrored left to right if it is on the bottom)
CONN_1-2834021-3 = drill 1.219 pad 2.286 square: 1 0,0 | drill 1.219 pad 2.54: 2 2.5,5 | drill 1.219 pad 2.286: 3 5,0
CAPC0603X33N = smd 0.38 x 0.4: 1 -0.281,0; 2 0.281,0
G-188 = smd 0.864 x 0.813: 1 -0.724,0; 2 0.724,0
CAPC2012X140N = smd 1.15 x 1.45: 1 -0.9,0; 2 0.9,0
CAPPC3528X210N = smd 1.34 x 3.02: 1 -1.54,0; 2 1.54,0
CAPAE430X550N = smd 2.42 x 1.58: 1 -1.65,0; 2 1.65,0
U1-PP = drill 0.991 pad 3.048 square: 1 -7.493,0 | drill 0.991 pad 3.048: 2 0,0
PCAP_6.3X5.4-ELECT = smd 2.997 x 1.6: 1 -2.705,0; 2 2.705,0
U2-K = smd 2.616 x 1.626: 1 -2.705,0; 2 2.705,0
THM30-1211 = drill 1.016 pad 3.048 square: 1 0,0 | drill 1.016 pad 3.048: 2 0,-5.08; 3 -45.72,2.54; 4 -45.72,-7.62; 5 -45.72,-17.78; 6 0,-15.24
TEN50-1212 = drill 1.016 pad 3.048 square: 1 0,0 | drill 1.016 pad 3.048: 2 0,-5.08; 3 0,-15.24; 4 -45.72,2.54; 5 -45.72,-7.62; 6 -45.72,-17.78
THN30-1215 = drill 1.016 pad 3.048 square: 1 0,0 | drill 1.016 pad 3.048: 2 0,5.08; 3 21.59,-7.62; 4 21.59,2.54; 5 21.59,12.7; 6 0,12.7
ACS70331EESATR-2P5U3 = smd 1.524 x 1.27: 1_2 -1.372,0.762; 3_4 -1.372,-0.762 | smd 0.3 x 1.143: 5 0.25,-1.651; 6 0.75,-1.651; 11 0.75,1.651; 12 0.25,1.651 | smd 1.143 x 0.3: 7 1.651,-0.75; 8 1.651,-0.25; 9 1.651,0.25; 10 1.651,0.75
CON4_2X2_P3MM_VMNL2 = drill 1.016 pad 1.727: 1 -2.997,2.997; 2 0,2.997; 3 -2.997,0; 4 0,0
77311-118-02LF = drill 0.965 pad 1.524 square: 1 2.54,0 | drill 1.016 pad 1.524: 2 0,0
XT60 = drill 4.064 pad 5.715 octagon: + 4.5,0; - 11.5,0
SOT-223 = smd 0.851 x 1.761: 1 -2.3,-3.025; 2 0,-3.025; 3 2.3,-3.025 | smd 3.151 x 1.761: 4 0,3.025
RC0603N = smd 0.756 x 0.8: 1 -0.778,0; 2 0.778,0
RES_0402_NTC = smd 0.457 x 0.66: 1 -0.699,0; 2 0.699,0
RES_2037 = smd 1.524 x 4.318: 1 -1.27,0; 2 1.27,0
STA_RNCP1206 = smd 1.27 x 1.702: 1 -1.372,0; 2 1.372,0
RC0402N = smd 0.656 x 0.5: 1 -0.553,0; 2 0.553,0
RC0805N = smd 1.006 x 1.2: 1 -0.853,0; 2 0.853,0
RES_CRCW_0402 = smd 0.66 x 0.559: 1 -0.546,0; 2 0.546,0
RMCF0805FT10K0 = smd 0.97 x 1.38: 1 -0.93,0; 2 0.93,0
RMCF0805FT1K00 = smd 1.24 x 1.5: 1 -0.95,0; 2 0.95,0
TMP100NA/3K = smd 1.21 x 0.58: 1 -1.255,0.95; 2 -1.255,0; 3 -1.255,-0.95; 4 1.255,-0.95; 5 1.255,0; 6 1.255,0.95
SOT-23 = smd 0.559 x 1.422: 1 -0.953,-0.965; 2 0.953,-0.965; 3 0,0.965
DIP8_IL = drill 0.813 pad 1.321 square: 1 -7.62,7.62 | drill 0.813 pad 1.321: 2 -7.62,5.08; 3 -7.62,2.54; 4 -7.62,0; 5 0,0; 6 0,2.54; 7 0,5.08; 8 0,7.62
SOT-23-5_MC = smd 1.321 x 0.559: 1 -1.295,0.95; 2 -1.295,0; 3 -1.295,-0.95; 4 1.295,-0.95; 5 1.295,0.95
MAX17205G+T = smd 1.016 x 0.22: 1 -1.651,1.2; 2 -1.651,0.8; 3 -1.651,0.4; 4 -1.651,0; 5 -1.651,-0.4; 6 -1.651,-0.8; 7 -1.651,-1.2; 8 1.651,-1.2; 9 1.651,-0.8; 10 1.651,-0.4; 11 1.651,0; 12 1.651,0.4; 13 1.651,0.8; 14 1.651,1.203 | smd 1.7 x 2.3: 15 0,0
TMV0503SHI = drill 0.813 pad 1.778 square: 1 0,0 | drill 0.813 pad 1.778: 2 2.54,0; 4 10.16,0; 5 12.7,0; 6 15.24,0
CZRU = smd 0.66 x 0.61: 1 -0.876,0; 2 0.876,0
D8 = smd 2.413 x 0.559: 1 -2.667,1.905; 2 -2.667,0.635; 3 -2.667,-0.635; 4 -2.667,-1.905; 5 2.667,-1.905; 6 2.667,-0.635; 7 2.667,0.635; 8 2.667,1.905
TO252-3 = smd 0.711 x 1.702: 1 -2.3,-5.867; 3 2.3,-5.867 | smd 6.756 x 8.001: 2 0,0
DBQ0016A_N = smd 1.905 x 0.406: 1 -2.705,2.223; 2 -2.705,1.587; 3 -2.705,0.953; 4 -2.705,0.318; 5 -2.705,-0.318; 6 -2.705,-0.953; 7 -2.705,-1.587; 8 -2.705,-2.223; 9 2.705,-2.223; 10 2.705,-1.587; 11 2.705,-0.953; 12 2.705,-0.318; 13 2.705,0.318; 14 2.705,0.953; 15 2.705,1.587; 16 2.705,2.223
IPT1-110-01-L-D = drill 0.889 pad 1.524 square: P$1 -8.89,5.08 | drill 0.813 pad 1.524: P$2 -8.89,7.62 | drill 0.889 pad 1.524: P$3 -6.35,5.08; P$4 -6.35,7.62; P$5 -3.81,5.08; P$6 -3.81,7.62; P$7 -1.27,5.08; P$8 -1.27,7.62; P$9 1.27,5.08; P$10 1.27,7.62; P$11 3.81,5.08; P$12 3.81,7.62; P$13 6.35,5.08; P$14 6.35,7.62; P$16 8.89,7.62; P$17 11.43,5.08; P$18 11.43,7.62; P$19 13.97,5.08; P$20 13.97,7.62 | drill 0.889: P$15 8.89,5.08

### Placement (x,y rotation side)
+5V  140.97,58.42 90 top
+12V  140.97,69.85 90 top
+24V  140.97,46.99 90 top
C1  22.86,15.24 270 top
C2  26.78,6.31 0 bottom
C3  25.4,2.54 0 bottom
C4  25.4,64.77 0 bottom
C5  19.05,68.58 270 bottom
C6  88.9,17.78 0 top
C7  106.68,34.29 180 bottom
C8  105.41,24.13 0 bottom
C9  88.9,19.05 180 bottom
C10  15.24,41.91 0 top
C11  15.24,22.86 0 top
C12  105.41,8.89 90 top
C13  127,36.83 270 top
C14  139.05,31.39 180 bottom
C15  104.14,81.28 90 top
C16  92.21,75.83 0 bottom
C17  100.58,8.89 90 top
C18  62.23,7.62 0 top
C19  50.8,40.64 90 bottom
C20  86.36,63.5 0 top
C21  90.93,33.78 270 bottom
C22  15.24,80.01 0 top
C23  120.9,19.3 270 top
C24  15.24,60.96 0 top
C25  96.52,24.13 180 bottom
DCDC5  31.75,39.37 180 top
DCDC12  31.75,68.58 180 top
DCDC24  31.75,15.24 0 top
FAN_A  140.97,81.28 90 top
FAN_B  102.87,44.45 0 top
I5  86.61,34.29 270 bottom
I12  86.36,63.5 270 bottom
I24  62.23,7.62 270 bottom
INTEL/NUC  91.44,83.82 180 top
J1  146.05,26.67 270 top
J2  140.97,26.67 270 top
J5  6.35,5.08 0 top
Q-FAN_A  125.73,73.66 0 top
Q-FAN_B  115.57,45.72 0 top
Q/M8  139.7,35.56 0 top
R1  48.26,85.6 270 bottom
R2  58.42,82.04 180 bottom
R3  69.6,81.28 90 bottom
R4  48.51,70.36 90 bottom
R5  44.45,10.16 90 bottom
R6  17.78,13.97 90 bottom
R7  41.91,8.89 90 bottom
R9  47.5,12.7 90 bottom
R10  52.07,2.54 0 top
R11  11.43,11.43 180 top
R12  114.3,60.96 90 top
R13  102.87,35.56 180 top
R14  118.11,20.32 0 bottom
R15  58.93,16.51 270 top
R16  67.31,86.36 0 bottom
R17  25.4,50.8 90 top
R19  133.35,57.15 0 bottom
R20  113.03,38.1 90 top
R21  24.13,80.01 90 top
R22  24.13,24.13 90 top
R30  86.36,57.15 0 top
TMP_POWER  46.99,39.37 180 bottom
U2  64.77,81.28 270 bottom
U3  107.95,58.42 0 top
U4  58.42,73.66 270 bottom
U5  26.67,10.16 180 bottom
U6  77.47,25.4 180 top
U7  33.02,7.62 270 bottom
U8  38.1,7.62 270 bottom
U9  69.85,15.24 0 top
U10  24.13,54.61 180 bottom
U11  120.65,64.77 180 top
U20  115.57,22.86 180 top
X1  125.73,1.27 0 top

### Tracks (layer width: path | path; a pad name or v marks a point on that pad's centre or on a via)
5_REG  (via drill 0.35)
  Top 0.254: 57.66,62.23 57.66,61.72 | v57.66,70.61 57.66,62.74 | 57.66,61.72 61.47,57.91 74.93,57.91 76.45,59.44 83.06,59.44 85.34,57.15 R30.1 85.6,57.15 85.6,48.77 103.38,30.99 v103.38,27.69 | 57.66,62.23 57.4,62.23 | 57.4,62.23 57.15,62.23 | 57.66,61.72 57.4,61.98 | 57.4,61.98 57.15,62.23 | 57.66,62.23 57.4,61.98 | 57.15,62.23 57.53,62.61 | 57.53,62.61 57.66,62.74 | 57.66,62.74 57.66,62.23 | 57.53,62.61 57.53,62.36 57.4,62.23 | U9.1 64.9,17.15 v64.77,17.27 | v26.92,62.23 57.15,62.23 | U20.16 111.09,20.64 110.49,20.03 v110.49,18.8
  Route2 0.254: v64.77,17.27 77.72,17.27 84.58,24.13 v94.23,24.13
  Route15 0.254: v94.23,24.13 94.23,25.91 96.01,27.69 v103.38,27.69
  Bottom 0.254: R14.1 118.89,19.3 118.38,18.8 v110.49,18.8 109.22,18.8 107.33,20.69 107.33,23.62 106.82,24.13 C8.1 106.17,24.13 106.17,25.65 104.14,27.69 v103.38,27.69 | C25.1 v94.23,24.13 | C4.1 26.92,64.15 v26.92,62.23 26.92,60.97 U10.3 | U4.5 57.66,72.18 v57.66,70.61
EN_V12
  Top 0.254: X1.P$18 135.89,7.62 135.89,5.18 133.25,2.54 116.33,2.54 115.32,3.56 115.32,21.98 115.88,22.54 U20.4
EN_V24  (via drill 0.35)
  Top 0.254: v131.83,23.37 134.62,20.57 X1.P$16 | U20.5 119.7,23.18 v120.65,24.13
  Bottom 0.203: v131.83,23.37 131.06,24.13 v120.65,24.13
EN_VBAT  (via drill 0.35)
  Top 0.254: U20.3 116.66,21.91 116.44,21.68 v116.44,17.52 | v116.44,17.52
  Route15 0.254: v116.44,17.52 137.93,17.52 139.7,15.75 X1.P$20
GND  (via drill 0.3 pad 1.3, 0.35)
  Top 0.254: DCDC24.2 45.97,20.32 50.8,15.49 58.93,15.49 R15.2 58.93,15.75 | 19.05,23.11 15.49,23.11 C11.2 | 19.05,23.11 24.13,23.11 R22.1 | C22.2 16,79.25 24.13,79.25 R21.1 | 19.05,23.11 22.86,19.3 C1.1 | U20.15 114.21,21.27 114.53,21.59 114.53,24.8 | U20.9 114.24,25.08 | 114.53,24.8 114.24,25.08 | 114.53,24.8 114.53,25.31 | 114.53,25.31 114.53,26.55 113.91,27.18 v112.78,27.18 | 114.24,25.08 114.3,25.08 114.53,25.31
  Top 0.381: v64.77,13.21 64.9,13.34 U9.4
  Top 0.508: R17.1 25.4,46.23 27.18,44.45 DCDC5.2
  Top 2.54: v58.42,78.49 v45.21,78.49 | DCDC24.2 36.86,20.32 v42.4,14.79
  Route2 1.27: v93.98,29.46 98.3,25.15 98.3,21.59 100.58,19.3 v103.63,19.3
  Route2 2.54: v45.21,78.49 v58.42,78.49
  Route15 2.54: C22.2 C24.2 C10.2 C11.2 | v45.21,78.49 v58.42,78.49 | DCDC24.2 36.86,20.32 v42.4,14.79
  Bottom 0.254: U4.2 v58.42,78.49 | R7.1 42.48,7.62 43.18,7.62 | R5.1 44.45,8.64 | C25.2 97.08,24.13 97.08,23.65 96.55,23.12 93.81,23.12 92.82,24.11 78.85,24.11 | U5.4 U5.15
  other vias: 40.64,6.86
  pour Bottom (isolate 0.457, no thermals): 1.52,89.28 150.5,89.28 150.62,89.15 150.62,1.02 1.78,1.02 1.52,1.27
GROUND  (via drill 0.3 pad 1.3, 0.35)
  Top 0.254: C20.2 v91.44,63.5 | C17.2 100.33,9.43 100.33,9.91 | 119.86,26.67 v119.89,26.67 | U20.2 121.27,21.27 121.79,21.79 121.79,24.77 v119.89,26.67 | U20.8 119.55,25.08 119.89,25.42 v119.89,26.67 | C23.2 120.9,18.27 120.91,18.26 | C18.2 65.1,7.62 v66.82,5.9
  Route2 2.286: INTEL/NUC.2 INTEL/NUC.4
  Route2 2.54: Q/M8.4 Q/M8.2 139.7,45.72 +24V.1
  Route15 1.27: v119.89,26.67 v131.32,26.67
  Bottom 0.254: U3.5 107.95,57.15 | 107.95,57.15 107.95,56.9 | 107.95,56.9 107.95,56.64 | 107.95,56.64 107.95,48.51 105.92,46.48 105.92,37.08 107.44,35.56 107.44,34.29 C7.2 | TMP_POWER.5 TMP_POWER.2 | 107.7,56.9 98.04,56.9 v91.44,63.5 91.44,63.49 91.2,63.25 I12.5 | 107.7,56.9 107.95,56.9 | C21.2 90.89,33.54 | C16.2 90.97,76.78 90.97,80.36 INTEL/NUC.2 | C9.2 89.44,19.3 89.44,21.05 88.14,22.35 76.45,22.35 74.93,23.88 U6.2 74.93,27.69 77.22,29.97 87.4,29.97 90.55,33.11 | 107.7,56.9 107.95,56.64 | 107.7,56.9 107.95,57.15 | I24.5 66.25,7.37 66.82,6.8 v66.82,5.9 | C21.2 90.66,33.23 | 90.66,33.23 90.55,33.11 | I5.5 89.62,34.04 90.16,33.5 | 90.16,33.5 90.25,33.4 | 90.25,33.4 90.55,33.11 | C21.2 90.16,33.5 | 90.25,33.4 90.3,33.4 90.47,33.24 90.65,33.24 90.66,33.23 | C14.2 139.7,31.75 Q/M8.4
  Bottom 0.381: TMP_POWER.5 50.8,39.37 C19.1
  Bottom 0.508: DCDC24.5 53.34,36.83 50.8,39.37
  pour Top (isolate 0.457, no thermals): 1.52,1.4 1.52,89.28 150.5,89.28 150.62,89.15 150.62,1.02 1.91,1.02
I_5  (via drill 0.35)
  Route2 0.254: v85.86,31.09 99.47,31.09 101.09,29.46 101.09,25.4 110.74,15.75 141.48,15.75 142.75,14.48 142.75,7.37 141.73,6.35 X1.P$19
  Bottom 0.254: I5.10 v85.86,31.09
I_12  (via drill 0.35)
  Route15 0.254: v85.64,59.63 85.64,58.64 119.13,25.15 135.64,25.15 144.78,16 144.78,4.57 142.49,2.29 138.18,2.29 137.16,3.3 X1.P$17
  Bottom 0.203: 85.61,59.66 v85.64,59.63
  Bottom 0.254: I12.10 85.61,59.66
I_24  (via drill 0.35)
  Route2 0.254: v61.47,4.83 63.75,2.54 131.83,2.54 134.62,5.33 X1.P$15
  Bottom 0.254: I24.10 61.48,4.84 v61.47,4.83
N$2
  Top 0.254: R13.1 107.16,35.56 116.08,26.65 116.08,25.15 116.78,24.45 U20.7
N$3
  Bottom 0.254: R3.2 69.6,82.04 69.41,82.23 U2.1
N$4
  Bottom 0.254: U2.3 63.04,82.04 R2.2
N$5
  Bottom 0.254: R4.1 48.53,69.6 58.17,69.6 59.37,70.8 U4.4 61.19,72.36 62.48,73.66 70.1,73.66 76.71,80.26 80.01,80.26 86.87,87.12 93.98,87.12 96.77,84.33 96.77,64.52 U3.3
N$6  (via drill 0.35)
  Top 0.203: DCDC12.3 28.96,81.03 24.13,81.03 R21.2
  Top 0.254: U20.13 110.17,22.54 v109.98,22.35
  Route15 0.254: DCDC12.3 27.69,83.82 26.16,82.3 26.16,66.04 25.15,65.02 25.15,60.96 26.16,59.94 26.16,7.87 30.99,3.05 78.23,3.05 82.04,6.86 82.04,17.53 86.87,22.35 v109.98,22.35
N$7  (via drill 0.35)
  Top 0.254: R11.1 12.36,11.81 v21.59,11.81 22.86,13.08 C1.2
  Bottom 0.203: U5.5 22.84,10.56
  Bottom 0.254: 22.84,10.56 v21.59,11.81
N$8
  Bottom 0.203: R5.2 42.86,12.45 31.75,12.45 30.26,10.96 U5.9
N$9
  Top 0.254: R30.2 93.98,57.15 U3.2
N$10  (via drill 0.35)
  Top 0.254: U20.10 111.54,24.45 110.74,25.25 v110.74,26.16
  Bottom 0.254: R14.2 116.82,19.81 109.73,19.81 108.97,20.57 108.97,25.65 109.47,26.16 v110.74,26.16
N$11
  Bottom 0.254: U3.1 100.33,85.6 97.54,88.39 85.09,88.39 79.76,83.06 76.96,83.06 70.61,76.71 64.26,76.71 61.21,73.66 57.88,73.66 57.51,74.03 57.51,74.92 U4.1
N$12
  Bottom 0.254: X1.P$5 121.92,4.92 122.68,4.16 144.23,4.16 145.94,5.88 145.94,24.02 J1.1
N$13
  Top 0.203: U11.4 119.29,65.79 118.11,65.79 114.3,61.98 R12.2 114.3,61.72 113.79,61.72 113.03,60.96 U3.6
N$14  (via drill 0.35)
  Top 0.254: DCDC24.6 28.96,25.15 24.13,25.15 R22.2 | U20.12 111.19,23.18 v110.24,24.13
  Route15 0.254: DCDC24.6 36.58,23.11 107.44,23.11 108.46,24.13 v110.24,24.13
N$15  (via drill 0.35)
  Top 0.254: U20.14 110.81,21.91 v109.98,21.08
  Route15 0.254: v72.14,80.52 72.39,80.26 72.39,53.59 74.93,51.05 91.69,51.05 114.55,28.19 114.55,21.59 114.05,21.08 v109.98,21.08
  Bottom 0.203: R3.1 69.61,80.52 v72.14,80.52
N$16
  Bottom 0.254: X1.P$7 124.46,5.55 125.29,4.72 142.31,4.72 144.69,7.09 144.69,18.13 140.95,21.87 140.95,24.11 J2.1
N$17
  Top 0.254: DCDC5.5 72.14,51.82 25.4,51.82 R17.2
N$18
  Top 0.254: DCDC24.4 53.59,17.53 58.93,17.53 R15.1
N$19
  Bottom 0.254: DCDC12.6 R16.1
N$21  (via drill 0.35)
  Top 0.254: Q-FAN_A.4 v125.73,78.74
  Top 0.381: Q-FAN_A.4 Q-FAN_A.2
  Bottom 0.381: v125.73,78.74 130.77,83.78 FAN_A.2
N$22
  Top 0.254: R20.1 115.35,37.55 129.54,23.37 X1.P$12
N$23
  Bottom 0.254: R19.1 134.29,57.15 134.51,56.92 134.51,55.26 139.99,49.78 142.49,49.78 144.27,48.01 144.27,33.53 132.08,21.34 X1.P$14
N$24
  Top 0.254: R20.2 113.03,42.45 Q-FAN_B.1
N$25
  Bottom 0.254: U5.1 24.12,8.96 23.91,8.75 23.91,6.86 24.47,6.29 26.05,6.29 C2.2
N$26  (via drill 0.35)
  Top 0.381: v125.98,68.07 124.21,68.07 123.43,68.85 Q-FAN_A.1
  Bottom 0.254: 130.09,63.97 130.09,58.38 131.31,57.15 R19.2
  Bottom 0.381: v125.98,68.07 130.09,63.97
N$27
  Top 0.254: 115.57,48.77 Q-FAN_B.4
  Top 0.508: Q-FAN_B.4 Q-FAN_B.2 | FAN_B.2 106.05,48.77 115.57,48.77
N$28
  Bottom 0.203: R7.2 40.18,11.32 31.96,11.32 31.2,10.56 U5.10
N$31
  Bottom 0.203: 24.13,2.54 21.35,5.32 21.35,9.38 21.73,9.76 U5.3
  Bottom 0.254: C3.2 24.13,2.54
N$32  (via drill 0.35)
  Top 0.203: v23.62,13.84 23.75,13.84
  Top 0.254: v30.48,7.87 29.72,7.87 23.75,13.84
  Bottom 0.203: U5.6 U5.7 | U5.13 28.99,9.36
  Bottom 0.254: U5.7 23.62,12.76 v23.62,13.84 | 28.99,9.36 v30.48,7.87
N$34  (via drill 0.35)
  Route15 0.254: v39.37,9.65 43.43,9.65 45.97,7.11 v47.5,7.11
  Bottom 0.203: U5.11 38.86,10.16
  Bottom 0.254: R9.1 v47.5,7.11 | 38.86,10.16 v39.37,9.65 39.37,8.79 39.07,8.5 U8.1
N$35  (via drill 0.35)
  Top 0.254: v35.31,8.64 44.45,8.64 50.55,2.54 R10.1
  Bottom 0.203: U5.12 31.76,9.76
  Bottom 0.254: 31.76,9.76 U7.1 35.17,8.5 v35.31,8.64
POWER+  (via drill 0.35)
  Top 0.254: R11.2 10.92,11.43 10.92,5.08 J5.+ | v23.11,60.71 23.11,66.29 25.4,68.58 DCDC12.1
  Top 2.54: DCDC12.1 31.83,68.5 38.02,68.5 40.65,71.14 40.65,85.19 38.52,87.32 11.3,87.32 7.75,83.77 C22.1 C24.1 C10.1 C11.1 7.75,8.18 J5.+
  Route2 2.54: 40.78,65.87 38.07,68.58 DCDC12.1 37.76,68.58 40.83,71.65 40.83,72.91 | 40.78,65.87 40.78,42.4 | DCDC5.1 37.75,39.37 40.78,42.4 | J5.+ 7.75,8.18 C11.1 C10.1 C24.1 C22.1 7.75,84.17 11.29,87.71 38.38,87.71 40.83,85.25 40.83,72.91 | 40.83,72.91 40.78,72.86 40.78,65.87 | 40.78,42.4 40.78,19.35 36.67,15.24 DCDC24.1
  Route15 2.54: J5.+ 7.75,8.18 C11.1 C10.1 C24.1 C22.1 7.75,84.06 11.35,87.66 38.12,87.66 40.63,85.15 40.63,71.24 37.81,68.42 31.91,68.42 DCDC12.1
  Bottom 0.254: 19.05,70.1 C5.1 30.21,70.12 DCDC12.1 | C24.1 7.62,60.96 | R16.2 48.28,86.36 R1.1 41.66,86.38 | 40.64,85.09 41.66,86.11 41.66,86.38 | 41.66,86.38 41.39,86.11 39.62,86.11 39.89,86.38 41.66,86.38 | v23.11,60.71 22.88,60.48 U10.1
  Bottom 2.54: C22.1 7.62,79.88 7.62,60.96 7.62,42.04 C10.1 C11.1 7.75,8.18 J5.+ | 7.75,83.95 11.43,87.63 38.1,87.63 39.62,86.11 40.64,85.09 40.64,71.12 | 40.64,71.12 40.64,41.91 | 40.64,41.91 40.64,19.05 36.83,15.24 DCDC24.1 | DCDC5.1 38.1,39.37 40.64,41.91 | 40.64,71.12 38.1,68.58 DCDC12.1
  Bottom 3.81: C22.1 7.75,83.95
POWER-  (via drill 0.35)
  Top 0.254: J5.- 21.54,5.08 22.35,5.89 v22.35,7.75
  Bottom 0.254: U5.2 23.39,9.36 22.35,8.32 v22.35,7.75
  Bottom 2.54: J5.- 17.85,12.63 R6.1
POWER_5
  Bottom 0.254: I5.1_2 85.6,35.66
  Bottom 1.27: DCDC5.3 78.64,35.66 85.6,35.66
POWER_12
  Bottom 0.254: I12.1_2 85.34,65.13
  Bottom 1.27: 85.34,65.13 85.34,64.87
  Bottom 1.524: 84.43,66.04 85.34,65.13
  Bottom 2.54: DCDC12.4 84.43,66.04
POWER_24
  Bottom 0.254: 61.21,9.25 I24.1_2 60.89,8.99 60.58,9.3
  Bottom 2.54: 60.58,9.3 55.02,9.3 DCDC24.3
SCL_BATT  (via drill 0.35)
  Top 0.254: v95.25,11.94 92.58,14.61 U9.6
  Route15 0.254: v95.25,11.94 122.97,11.94 124.46,10.44 X1.P$8
SCL_GAUGE  (via drill 0.35)
  Top 0.254: v47.5,16.76 49.78,14.48 50.08,14.19 61.81,14.19 62.23,14.61 U9.3
  Bottom 0.254: R9.2 v47.5,16.76
SCL_TEMP  (via drill 0.35)
  Route2 0.254: X1.P$9 v127,3.39
  Bottom 0.203: 45.72,32.77 45.47,32.51 45.47,7.62 50.55,2.54
  Bottom 0.254: v127,3.39 126.14,2.54 50.55,2.54 | 45.72,32.77 45.73,32.78 TMP_POWER.1
SDA_BATT  (via drill 0.35)
  Top 0.254: X1.P$10 v127,14.73 | U9.7 99.44,15.87 v99.57,15.75
  Bottom 0.203: v99.57,15.75 125.98,15.75 v127,14.73
SDA_GAUGE
  Top 0.203: 53.59,3.22 53.59,2.54 R10.2
  Top 0.254: 53.59,3.22 62.56,12.19 68.66,12.19 69.24,12.77 69.24,15.49 68.86,15.87 U9.2
SDA_TEMP  (via drill 0.35)
  Route15 0.254: v116.59,3.56 117.19,4.16 128.82,4.16 129.54,4.88 X1.P$11
  Bottom 0.203: 48.26,34.04 51.05,31.24 51.05,5.84 53.34,3.56
  Bottom 0.254: v116.59,3.56 53.34,3.56 | TMP_POWER.6 48.25,34.05 48.26,34.04
VBATT_A  (via drill 0.35)
  Bottom 0.254: R1.2 48.51,84.57
  Bottom 0.381: R1.2 48.26,82.55 | 48.26,82.55 48.26,82.04 | 48.26,82.04 48.26,81.53 | 48.26,81.53 48.26,71.39 R4.2 | R2.1 48.77,82.04 | 48.26,82.04 v48.51,82.04 48.77,82.04 | 48.26,81.53 48.77,82.04 | 48.77,82.04 48.26,82.55
VBATT_B  (via drill 0.35)
  Top 0.203: v116.33,60.96 115.57,60.96 114.81,60.2 114.3,60.2 R12.1 | v123.44,62.74 123.44,63.25 122.87,63.82 U11.1 | 124.97,26.42 124.97,13.72
  Top 0.254: 124.97,13.72 121.92,10.67 X1.P$6 | v117.6,33.78 124.97,26.42
  Bottom 0.203: 117.86,60.96 122.94,60.96 123.44,61.47 v123.44,62.74 | 117.86,60.96 117.6,60.96 | 117.6,60.96 117.35,60.96 | 117.35,60.96 v116.33,60.96 | 117.6,60.96 117.6,60.71 | 117.35,60.96 117.6,60.71 | 117.6,60.71 117.86,60.96
  Bottom 0.254: v117.6,33.78 117.6,60.71
VCC_3.3  (via drill 0.35)
  Top 0.254: v85.09,17.78 C6.1
  Route15 0.254: X1.P$4 119.38,9.73 118.7,10.41 92.46,10.41 v85.09,17.78
  Bottom 0.254: U6.6 62.23,25.15 69.6,17.78 84.84,17.78 v85.09,17.78 87.35,17.78 C9.1
VCC_5  (via drill 0.35)
  Top 0.254: C20.1 82.55,63.5 v81.28,62.23 77.98,62.23 74.68,58.93 v61.98,58.93 | 102.11,35.56 R13.2 | 70.02,17.57 70.02,18.78 v70.62,19.39 | 69.98,17.22 69.98,16.76 70.08,16.86 | 70.08,16.86 70.08,11.76 69.12,10.81 62.37,10.81 59.18,7.62 | U9.8 70.37,17.15 | 70.37,17.15 70.21,16.99 | 70.21,16.99 70.08,16.86 | 70.02,17.57 69.98,17.61 69.98,17.22 | 70.02,17.57 70.37,17.22 70.37,17.15 | 70.08,17.13 70.21,16.99 | 69.98,17.22 70.08,17.13 | 70.08,17.13 70.08,16.86 | C18.1 59.18,7.62 | 59.18,7.62 58.42,6.86 v58.42,6.35 | C17.1 100.58,4.64 101.03,4.2 104.94,4.2 | 104.94,4.2 105.25,4.2 | 104.94,4.2 105.39,4.65 105.41,4.65 | 105.45,4.61 105.45,4.4 105.25,4.2 | 105.25,4.2 105.86,4.2 | U20.1 120.72,20.64 | 120.72,20.64 120.91,20.64 | 120.91,20.64 121.08,20.64 | 121.08,20.64 v122.92,20.64 v122.93,20.65 | C23.1 120.9,20.46 | 120.9,20.46 120.9,20.63 120.91,20.64 | 120.72,20.64 120.9,20.46 | 121.08,20.64 120.9,20.46
  Top 0.381: 118.87,61.72 119.89,61.72 120.02,61.59 119.25,61.59 118.87,61.21 | 120.65,60.96 118.11,60.96 | 118.36,61.21 118.87,61.21 | 118.87,61.21 119.89,61.21 120.14,61.47 | 120.4,61.21 120.69,60.92 +5V.2
  Top 0.508: 102.11,35.56 102.11,35.05 v102.87,34.29 107.7,29.46 107.7,16 110.24,13.46 110.24,5.33 | 109.73,4.83 110.24,4.83 | 110.24,4.83 110.74,4.83 | 110.74,4.83 v111.51,4.83 | 119.13,61.98 118.87,61.72 118.36,61.21 118.11,60.96 108.71,51.56 102.11,51.56 100.84,50.29 100.84,36.58 101.85,35.56 R13.2 | U11.5 119.35,62.26 120.02,61.59 120.14,61.47 120.4,61.21 120.65,60.96 | 110.24,5.33 110.24,4.83 | 109.73,4.83 109.1,4.2 105.86,4.2 105.45,4.61 105.41,4.65 C12.1 | 109.73,4.83 110.24,5.33 | 110.24,5.33 110.74,4.83
  Route2 0.254: v70.62,19.39 71.46,19.39 U6.1
  Route2 0.508: v111.51,4.83 118.87,4.83 119.38,5.33 X1.P$3 | v102.87,34.29 114.55,34.29 122.93,25.91 v122.93,20.65
  Bottom 0.254: v61.98,58.93 61.98,55.88 48.25,42.15 48.25,41.15 | TMP_POWER.3 TMP_POWER.4 | C19.2 48.85,40.92 | 48.85,40.92 48.54,40.61 | 48.54,40.61 TMP_POWER.4 | 48.25,41.15 TMP_POWER.4 | 48.85,40.92 48.47,40.92 48.38,41.01 | 48.38,41.01 48.25,41.15 | 48.38,41.01 48.38,40.77 48.54,40.61 | I24.12 58.93,7.37 58.42,6.86 v58.42,6.35 | I5.12 86.65,34.04 87.06,34.45 87.38,34.77 I5.3_4 | 90.93,35.63 90.93,37.08 81.28,46.74 v81.28,62.23 82.3,63.25 I12.12 | 90.97,35.66 90.93,35.63 | C21.1 90.93,35.63 | C7.1 v102.87,34.29
  Bottom 0.381: +5V.2 138.47,60.92 +5V.3
  Bottom 0.762: U6.1 86.32,25.4 93.67,32.75 93.67,35.66
  Bottom 1.27: I5.3_4 90.97,35.66 93.67,35.66 101.5,35.66 v102.87,34.29
VCC_12
  Top 1.27: 135.97,72.82 +12V.2 | 103.99,78.42 C15.1
  Top 2.54: J1.2 148.59,29.21 148.59,71.63 145.37,74.85 +12V.3 | 135.97,72.82 127.51,81.28 113.77,81.28 107.58,75.09 104.16,75.09 | INTEL/NUC.1 94.44,78.61 97.95,75.09 104.16,75.09 | C15.1 104.14,75.11 104.16,75.09
  Route2 2.286: INTEL/NUC.1 INTEL/NUC.3
  Bottom 0.254: 140.97,74.68 +12V.3 | 94.44,76.58 93.68,75.83 C16.1
  Bottom 1.524: I12.3_4 87.97,65.72
  Bottom 2.54: INTEL/NUC.1 94.44,76.58 94.44,70.22 89.94,65.72 87.97,65.72 | +12V.2 138.47,74.85 +12V.3
VCC_24
  Top 0.254: 127,39.62 C13.1
  Top 0.508: FAN_B.3 FAN_B.1
  Top 2.54: +24V.3 138.47,51.99 +24V.2 135.97,43.12 | 135.97,43.12 135.97,39.29 Q/M8.1 Q/M8.3 | C13.1 127,41.71 128.41,43.12 135.97,43.12
  Route15 2.54: J2.2 136.7,30.94 Q/M8.3
  Bottom 0.254: 107.95,44.45 FAN_B.3 | C14.1 136.8,31.39 136.72,31.31 | I24.3_4 63.55,9.55 63.88,9.55
  Bottom 0.508: 107.95,44.45 107.95,36.32 108.97,35.31 108.97,30.08
  Bottom 1.27: 136.72,35.54 Q/M8.3
  Bottom 1.524: 140.97,52.07 +24V.3
  Bottom 2.54: 136.72,35.54 136.72,31.31 135.49,30.08 108.97,30.08 101.44,30.08 99.64,28.27 99.64,20.9 88.29,9.55 63.88,9.55 | Q/M8.3 Q/M8.1 | FAN_A.3 FAN_A.1 144.78,77.47 144.78,55.88 140.97,52.07
(copper drawn outside any net)
  shapes: Bottom circle x5, Top area x1

### Text on the board
Top: PilotSCAN